# EasyEDA Pro project electronBot-AI_2025-11-24.epro

# Schematic BaseConnector
Board Name: BaseConnector; Create Date: 2025-05-26; Page Name: P1; Project Name: electronBot-AI; Schematic Name: BaseConnector; Update Date: 2025-05-26; Company: 嘉立创EDA; Page Size: A4; Version: V1.0
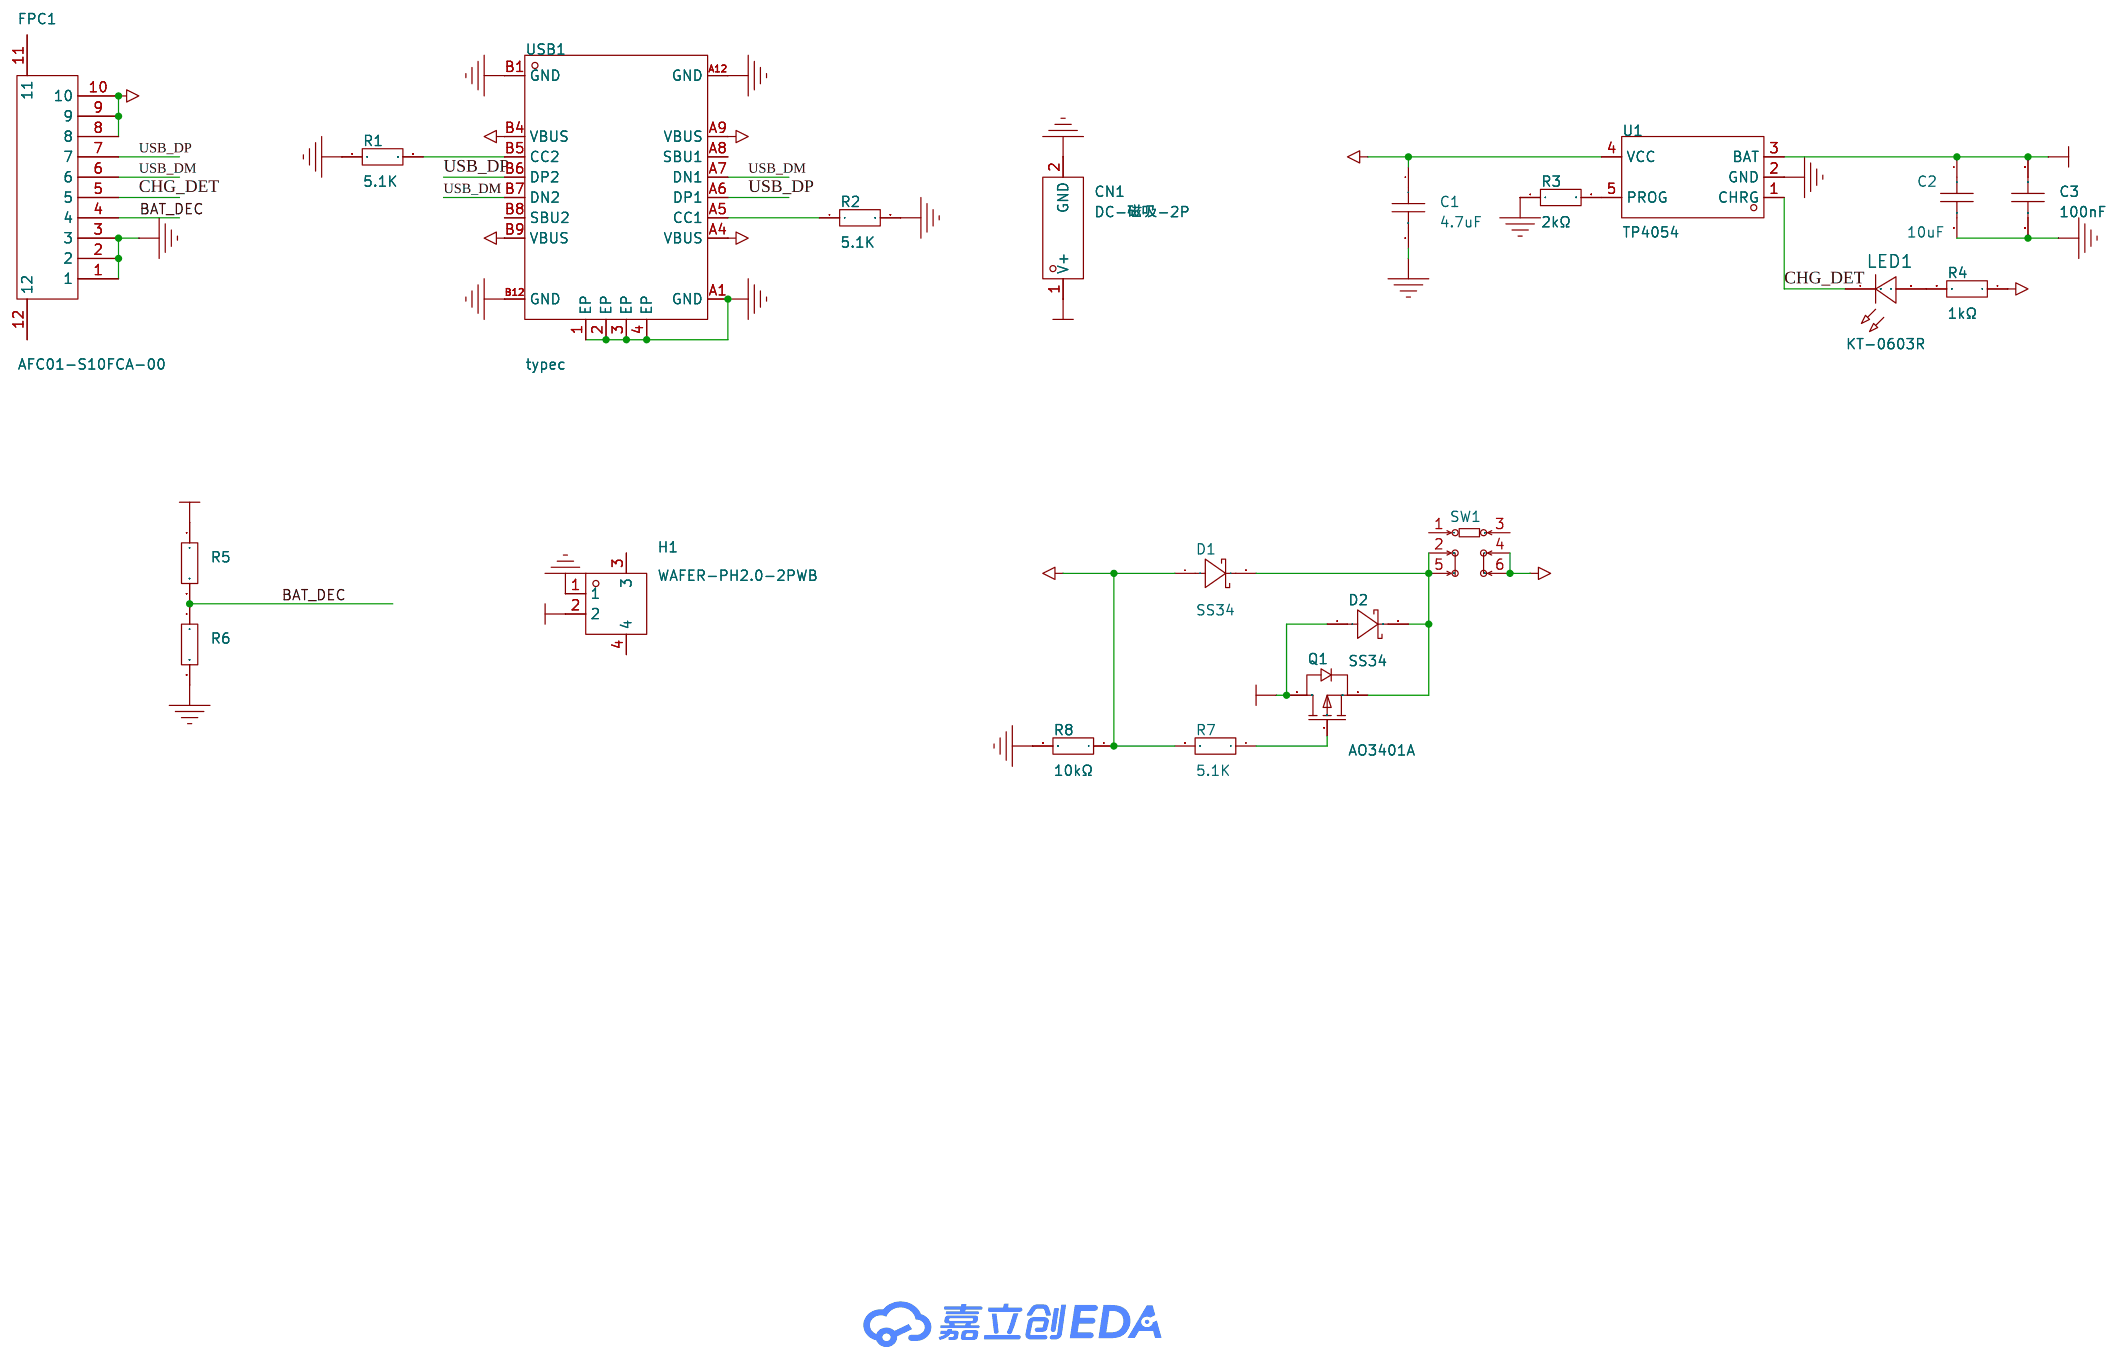
[diagram p0: schematic sheet]

## Parts
C1  4.7uF  [C0603]
C2  10uF  [C0603]
C3  100nF  [C0603]
CN1  DC-磁吸-2P  [2.5X2Pcixi]
D1  SS34  [SMA_L4.3-W2.6-LS5.0-FD]
D2  SS34  [SMA_L4.3-W2.6-LS5.0-FD]
FPC1  AFC01-S10FCA-00  [FPC-SMD_P0.5-10P_FGS-XJ-H2.0]
H1  WAFER-PH2.0-2PWB  [CONN-SMD_2P-P2.00_XUNPU_WAFER-PH2.0-2PWB]
LED1  KT-0603R  [LED0603-RD]
Q1  AO3401A  [SOT-23_L2.9-W1.3-P1.90-LS2.4-BR]
R1  5.1K  [R0603]
R2  5.1K  [R0603]
R3  2kΩ  [R0603]
R4  1kΩ  [R0603]
R5  100kΩ  [R0603]
R6  100kΩ  [R0603]
R7  5.1K  [R0603]
R8  10kΩ  [R0603]
SW1  XKB5858-Z-E  [SW-TH_XKB5858-Z-E]
U1  TP4054  [TSOT-23-5_L2.9-W1.6-P0.95-LS2.8-BR]
USB1  typec  [USB-C-SMD_KH-TYPE-C-16P]

## Library data of the parts
C1 = CL10A475KO8NNNC: 容值:4.7uF;精度:±10%;额定电压:16V;材质(温度系数):X5R;; LCSC Part Name: 4.7uF ±10% 16V; Supplier Part: C19666; Manufacturer: SAMSUNG(三星); Supplier Footprint: 0603; JLCPCB Part Class: Basic Part; Datasheet: https://atta.szlcsc.com/upload/public/pdf/source/20160218/1457707763339.pdf; Supplier: LCSC; Tolerance: ±10%; Voltage Rated: 16V; Temperature Coefficient: X5R
C2 = CL10A106KP8NNNC: 容值:10uF;精度:±10%;额定电压:10V;材质(温度系数):X5R;; LCSC Part Name: 10uF ±10% 10V; Supplier Part: C19702; Manufacturer: SAMSUNG(三星); Supplier Footprint: 0603; JLCPCB Part Class: Basic Part; Datasheet: https://atta.szlcsc.com/upload/public/pdf/source/20160218/1457707763339.pdf; Supplier: LCSC; Tolerance: ±10%; Voltage Rated: 10V; Temperature Coefficient: X5R
C3 = CC0603KRX7R9BB104: 容值:100nF;精度:±10%;额定电压:50V;材质(温度系数):X7R;; LCSC Part Name: 100nF ±10% 50V; Supplier Part: C14663; Manufacturer: YAGEO(国巨); Supplier Footprint: 0603; JLCPCB Part Class: Basic Part; Datasheet: https://atta.szlcsc.com/upload/public/pdf/source/20180910/C282072_33301C7F631E79921B82A8DAC6BCC5B3.pdf; Supplier: LCSC; Tolerance: ±10%; Voltage Rated: 50V; Temperature Coefficient: X7R
CN1 = DC-磁吸-2P: Supplier Part: C9900021679; Supplier Footprint: DIP-2; Supplier: LCSC
D1 D2 = SS34_C7420365: 二极管配置:独立式;正向压降(Vf):550mV@3.0A;直流反向耐压(Vr):40V;平均整流电流(Io):3A;; LCSC Part Name: 电压:40V 电流:3A; Supplier Part: C7420365; Manufacturer: 宏迦橙; Supplier Footprint: SMA(DO-214AC); JLCPCB Part Class: 扩展库; Datasheet: https://atta.szlcsc.com/upload/public/pdf/source/20230828/75438452AEE6C276EDA92B2AF599BE05.pdf; Supplier: LCSC; Diode Configuration: 独立式; Forward Voltage (Vf@If): 550mV@3.0A; Reverse Voltage (Vr): 40V; Average Rectified Current (Io): 3A; Reverse Leakage Current (Ir): 200uA@40V; Peak forward surge current: 80A
FPC1 = AFC01-S10FCA-00: 锁定特性:翻盖式;触点类型:下接;触点数量:10P;间距:0.5mm;安装类型:卧贴;; LCSC Part Name: 间距:0.5mm P数:10P 翻盖式 下接; Supplier Part: C262659; Manufacturer: JS(钜硕电子); Supplier Footprint: SMD,P=0.5mm,卧贴; Datasheet: https://atta.szlcsc.com/upload/public/pdf/source/20190816/C413942_2A72D1AC756EAE17EEDF756A339D4500.pdf; Supplier: LCSC; Locking Feature: 翻盖式; Contact Type: 下接; Number of Contacts: 10P; Pitch: 0.5mm; Mounting Type: 卧贴; FFC, FCB Thickness: 0.3mm; Height Above Board: 2mm
H1 = WAFER-PH2.0-2PWB: 插针结构:1x2P;间距:2mm;安装方式:卧贴;参考系列:PH;总PIN数:2P;排数:1;每排PIN数:2;行距:-;额定电流:2A;触头材质:黄铜;触头镀层:-;工作温度:-25℃~+85℃;; LCSC Part Name: 1x2P 间距:2mm 卧贴 系列:PH; Supplier Part: C3029440; Manufacturer: XUNPU(讯普); Supplier Footprint: SMD,P=2mm,卧贴; Datasheet: https://atta.szlcsc.com/upload/public/pdf/source/20220527/83903C18429EFE4C9EEE8C529A248431.pdf; Supplier: LCSC; Pins Structure: 1x2P; Pitch: 2mm; Mounting Type: 卧贴; Reference Series: PH; Number of Pins: 2P; Number of Rows: 1; Number of PINs Per Row: 2; Current Rating: 2A; Contact Material: 黄铜; Operating Temperature: -25℃~+85℃; Voltage Rating: 250V; Plastic Material: LCP; Supplementary Features: 辅助焊脚; Color: 米色; Z-Height of the Board: 5.6mm; X-Length of Bottom Edge on Board (Spacing Line): 8mm; Y-Width of Bottom Edge on Board: 8.5mm
LED1 = KT-0603R: 发光颜色:红色;功率:-;正向电流:-;主波长:-;二极管配置:-;透镜颜色:-;色温:-;发光角度:-;载带方式:-;工作温度:-40℃~+85℃;; LCSC Part Name: 0603 红灯 高亮; Supplier Part: C2286; Manufacturer: KENTO; Supplier Footprint: 0603; JLCPCB Part Class: Basic Part; Datasheet: https://atta.szlcsc.com/upload/public/pdf/source/20160616/1466072038404.pdf; Supplier: LCSC; Emitted Color: 红色; Operating Temperature: -40℃~+85℃
Q1 = AO3401A_C347476: 类型:1个P沟道;漏源电压(Vdss):30V;连续漏极电流(Id):4.2A;导通电阻(RDS(on)@Vgs,Id):50mΩ@10V;功率(Pd):1.4W;阈值电压(Vgs(th)@Id):400mV@250uA;; LCSC Part Name: 1个P沟道 耐压:30V 电流:4.2A; Supplier Part: C347476; Manufacturer: UMW(友台半导体); Supplier Footprint: SOT-23; JLCPCB Part Class: 扩展库; Datasheet: https://atta.szlcsc.com/upload/public/pdf/source/20231109/42F312EBB081D72F04A7E8221BFFAF9D.pdf; Supplier: LCSC; Type: 1个P沟道; Drain Source Voltage (Vdss): 30V; Continuous Drain Current (Id): 4.2A; Drain Source On Resistance (RDS(on)@Vgs,Id): 50mΩ@10V; Power Dissipation (Pd): 1.4W; Gate Threshold Voltage (Vgs(th)@Id): 400mV@250uA; Total Gate Charge (Qg@Vgs): 9.4nC@4.5V; Input Capacitance (Ciss@Vds): 954pF; Reverse Transfer Capacitance (Crss@Vds): 77pF; Operating Temperature: -55℃~+150℃
R1 R2 R7 = Res_0603: Supplier Footprint: 0603
R3 = 0603WAF2001T5E: 阻值:2kΩ;精度:±1%;功率:100mW;温度系数:±100ppm/℃;电阻类型:厚膜电阻;; LCSC Part Name: 2kΩ ±1% 100mW 厚膜电阻; Supplier Part: C22975; Manufacturer: UNI-ROYAL(厚声); Supplier Footprint: 0603; JLCPCB Part Class: Basic Part; Datasheet: https://atta.szlcsc.com/upload/public/pdf/source/20200306/C422600_1E6D84923E4A46A82E41ADD87F860B5C.pdf; Supplier: LCSC; Tolerance: ±1%; Power(Watts): 100mW; Overload Voltage (Max): 75V; Temperature Coefficient: ±100ppm/℃; Type: 厚膜电阻; Operating Temperature Range: -55℃~+155℃
R4 = 0603WAF1001T5E: 电阻类型:厚膜电阻;阻值:1kΩ;精度:±1%;功率:100mW;最大工作电压:75V;温度系数:±100ppm/℃;; LCSC Part Name: 1kΩ ±1% 100mW 厚膜电阻; Supplier Part: C21190; Manufacturer: UNI-ROYAL(厚声); Supplier Footprint: 0603; JLCPCB Part Class: Basic Part; Datasheet: https://atta.szlcsc.com/upload/public/pdf/source/20200306/C422600_1E6D84923E4A46A82E41ADD87F860B5C.pdf; Supplier: LCSC; Type: 厚膜电阻; Tolerance: ±1%; Power(Watts): 100mW; Overload Voltage (Max): 75V; Temperature Coefficient: ±100ppm/℃; Operating Temperature Range: -55℃~+155℃
R5 R6 = 0603WAF1003T5E: 电阻类型:厚膜电阻;阻值:100kΩ;精度:±1%;功率:100mW;最大工作电压:75V;温度系数:±100ppm/℃;; LCSC Part Name: 100kΩ ±1%; Supplier Part: C25803; Manufacturer: UNI-ROYAL(厚声); Supplier Footprint: 0603; JLCPCB Part Class: Basic Part; Datasheet: https://atta.szlcsc.com/upload/public/pdf/source/20200306/C422600_1E6D84923E4A46A82E41ADD87F860B5C.pdf; Supplier: LCSC; Type: 厚膜电阻; Tolerance: ±1%; Power(Watts): 1/10W; Temperature Coefficient: ±100ppm/℃; Overload Voltage (Max): 75V; Operating Temperature Range: -55℃~+155℃
R8 = 0603WAF1002T5E: 电阻类型:厚膜电阻;阻值:10kΩ;精度:±1%;功率:100mW;; LCSC Part Name: 厚膜电阻 10kΩ ±1% 100mW; Supplier Part: C25804; Manufacturer: UNI-ROYAL(厚声); Supplier Footprint: 0603; JLCPCB Part Class: 基础库; Datasheet: https://atta.szlcsc.com/upload/public/pdf/source/20200306/C422600_1E6D84923E4A46A82E41ADD87F860B5C.pdf; Supplier: LCSC; Type: 厚膜电阻; Tolerance: ±1%; Power(Watts): 100mW; Temperature Coefficient: ±100ppm/℃; Overload Voltage (Max): 75V; Operating Temperature Range: -55℃~+155℃
SW1 = XKB5858-Z-E: 自锁/无锁:自锁;安装方式:卧插;触点电流:100mA;额定电压 (AC):250V;额定电压 (DC):30V;带灯:不带;作用力:2.5N;机械寿命:10万次;; Supplier Part: C780038; Manufacturer: XKB Connection(中国星坤); Supplier Footprint: 插件; JLCPCB Part Class: 扩展库; Datasheet: https://atta.szlcsc.com/upload/public/pdf/source/20211011/56D3FA9FC185EAC41365C3B37B684CC1.pdf; Supplier: LCSC; Self Lock / No Lock: 自锁; Actuator Style: 方形按钮; Mounting Style: 卧插; Contact Current: 100mA; Voltage Rating (AC): 250V; Voltage Rating (DC): 30V; Insulation Resistance: 100MΩ; Actuator/Cap Color: 白色; With Lamp: 不带; Pin Style: PC引脚; Operating Force: 2.5N; Operating Temperature: -15℃~+55℃; Mechanical Life: 10万次
U1 = TP4054_C668215: 电源电压:6.5V;最大充电电流:500mA;电池类型:锂离子/聚合物;电池节数:1;; Supplier Part: C668215; Manufacturer: UMW(友台半导体); Supplier Footprint: SOT-23-5L; JLCPCB Part Class: 扩展库; Datasheet: https://atta.szlcsc.com/upload/public/pdf/source/20231109/1E60770826C4E1A0E5898BBC08FF3A57.pdf; Supplier: LCSC; Supply Voltage: 6.5V; Maximum Charge Current: 500mA; Type of Battery: 锂离子/聚合物; Number of Cells: 1; Operating Temperature: -40℃~+85℃
USB1 = typec: Supplier Part: C9900016956; Supplier Footprint: typec 12p; Supplier: LCSC

## Nets
GND: C1.2 C2.2 C3.2 CN1.2(GND) FPC1.1 FPC1.2 FPC1.3 H1.1 R1.1 R2.2 R3.1 R6.2 R8.2 U1.2(GND) USB1.1(EP) USB1.2(EP) USB1.3(EP) USB1.4(EP) USB1.A1(GND) USB1.A12(GND) USB1.B1(GND) USB1.B12(GND)
VBAT: C2.1 C3.1 CN1.1(V+) D2.1(A) H1.2 Q1.3(D) R5.1 U1.3(BAT)
VBUS: FPC1.8 FPC1.9 FPC1.10 SW1.4 SW1.6
VBUS_IN: C1.1 D1.1(A) R4.1 R7.2 R8.1 U1.4(VCC) USB1.A4(VBUS) USB1.A9(VBUS) USB1.B4(VBUS) USB1.B9(VBUS)
BAT_DEC: FPC1.4 R5.2 R6.1
CHG_DET: FPC1.5 LED1.1(C) U1.1(CHRG)
USB_DM: FPC1.6 USB1.A7(DN1) USB1.B7(DN2)
USB_DP: FPC1.7 USB1.A6(DP1) USB1.B6(DP2)
$1N1500: R1.2 USB1.B5(CC2)
$1N1502: R2.1 USB1.A5(CC1)
$1N5040: R3.2 U1.5(PROG)
$1N5043: LED1.2(A) R4.2
$1N5835: Q1.1(G) R7.1
$1N5920: D1.2(K) D2.2(K) Q1.2(S) SW1.2 SW1.5

Not connected (* = marked no-connect by the designer): FPC1 11 12; H1 3 4; SW1 1 3; USB1 A8(SBU1) B8(SBU2)

# Schematic connectBoard
Board Name: connectBoard; Create Date: 2025-05-26; Page Name: P1; Project Name: electronBot-AI; Schematic Name: connectBoard; Update Date: 2025-05-26; Company: 嘉立创EDA; Page Size: A4; Version: V1.0
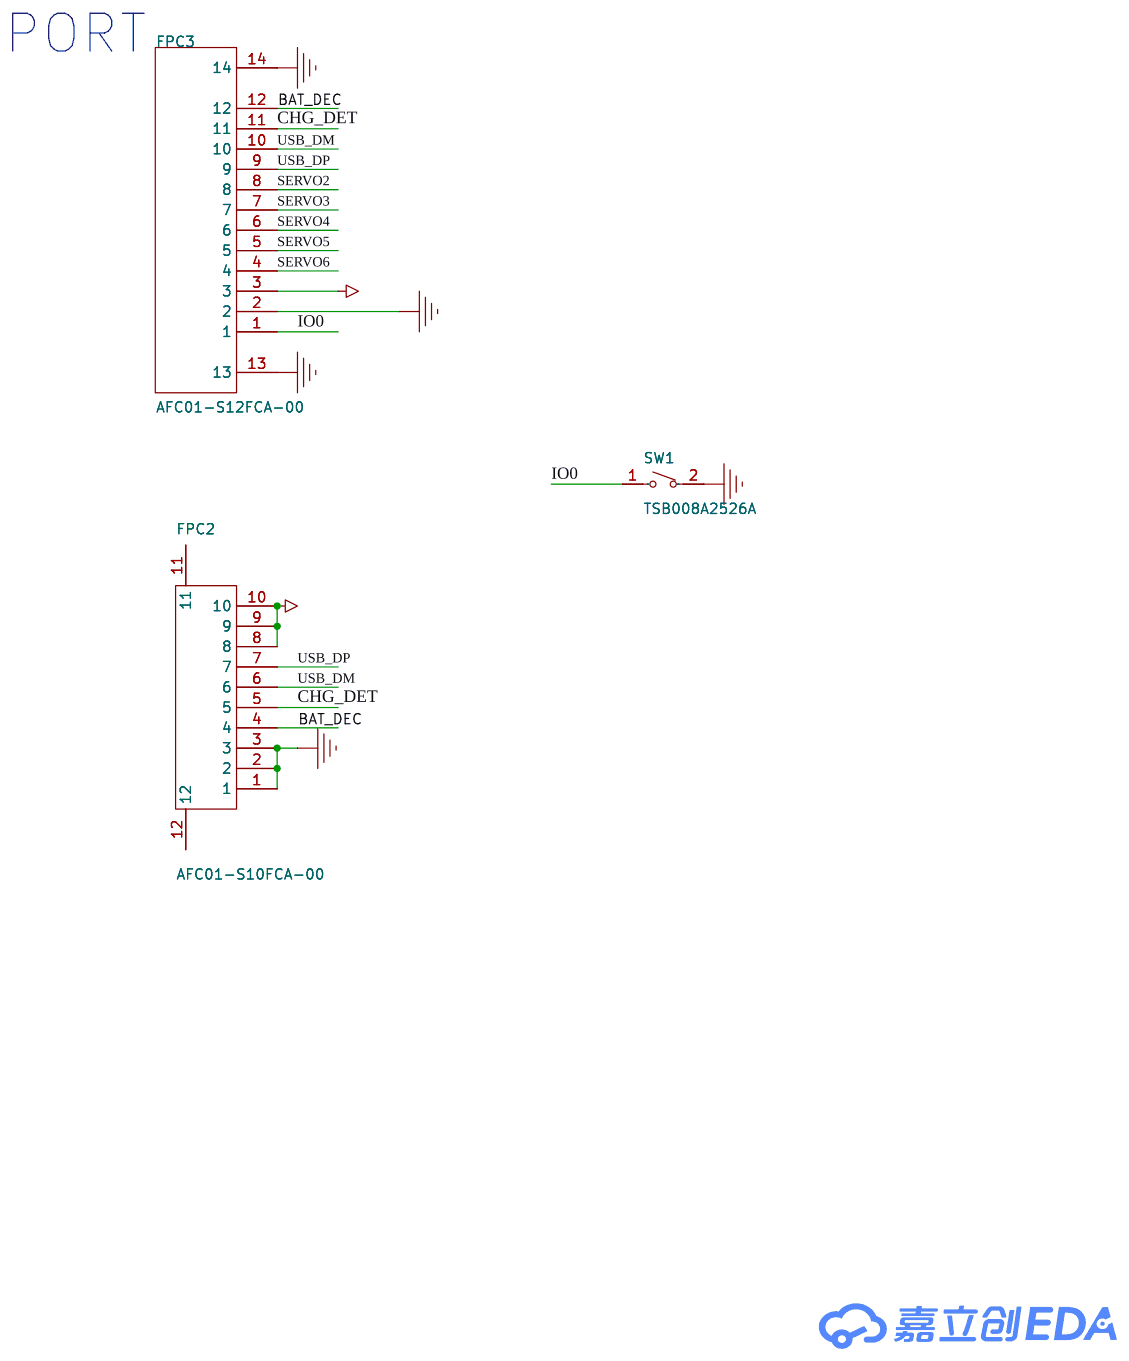
[diagram p1: schematic sheet]

## Parts
FPC2  AFC01-S10FCA-00  [FPC-SMD_P0.5-10P_FGS-XJ-H2.0]
FPC3  AFC01-S12FCA-00  [FPC-SMD_AFC01-S12FCA-00]
SW1  TSB008A2526A  [SW-SMD_L6.0-W3.5-LS8.0]

## Library data of the parts
FPC2 = AFC01-S10FCA-00: 锁定特性:翻盖式;触点类型:下接;触点数量:10P;间距:0.5mm;安装类型:卧贴;; LCSC Part Name: 间距:0.5mm P数:10P 翻盖式 下接; Supplier Part: C262659; Manufacturer: JS(钜硕电子); Supplier Footprint: SMD,P=0.5mm,卧贴; Datasheet: https://atta.szlcsc.com/upload/public/pdf/source/20190816/C413942_2A72D1AC756EAE17EEDF756A339D4500.pdf; Supplier: LCSC; Locking Feature: 翻盖式; Contact Type: 下接; Number of Contacts: 10P; Pitch: 0.5mm; Mounting Type: 卧贴; FFC, FCB Thickness: 0.3mm; Height Above Board: 2mm
FPC3 = AFC01-S12FCA-00: 锁定特性:翻盖式;触点类型:下接;触点数量:12P;间距:0.5mm;安装类型:卧贴;; LCSC Part Name: 间距:0.5mm P数:12P 翻盖式 下接; Supplier Part: C262661; Manufacturer: JS(钜硕电子); Supplier Footprint: SMD,P=0.5mm,卧贴; JLCPCB Part Class: 扩展库; Datasheet: https://atta.szlcsc.com/upload/public/pdf/source/20190816/C413942_2A72D1AC756EAE17EEDF756A339D4500.pdf; Supplier: LCSC; Locking Feature: 翻盖式; Contact Type: 下接; Number of Contacts: 12P; Pitch: 0.5mm; Mounting Type: 卧贴; FFC, FCB Thickness: 0.3mm; Height Above Board: 2mm
SW1 = TSB008A2526A: 按钮形状:矩形按钮;作用力:260gf;安装方式:立贴;开关长度:6mm;开关宽度:3.5mm;开关高度:2.5mm;触点电流:50mA;额定电压(AC):-;额定电压(DC):12V;机械寿命:-;; LCSC Part Name: 6*3.5*2.5mm 立贴 轻触开关; Supplier Part: C2888456; Manufacturer: BZCN(博众电气); Supplier Footprint: SMD; JLCPCB Part Class: 扩展库; Datasheet: https://atta.szlcsc.com/upload/public/pdf/source/20210826/69353A4A5CF55ED01B57EB383090AA0F.pdf; Supplier: LCSC; Actuator Style: 矩形按钮; Operating Force: 260gf; Mounting Style: 立贴; Switch Length: 6mm; Switch Width: 3.5mm; Switch Height: 2.5mm; Contact Current: 50mA; Voltage Rating (DC): 12V; Actuator/Cap Color: 白色

## Nets
GND: FPC2.1 FPC2.2 FPC2.3 FPC3.2 FPC3.13 FPC3.14 SW1.2
VBUS: FPC2.8 FPC2.9 FPC2.10 FPC3.3
BAT_DEC: FPC2.4 FPC3.12
CHG_DET: FPC2.5 FPC3.11
IO0: FPC3.1 SW1.1
SERVO2: FPC3.8
SERVO3: FPC3.7
SERVO4: FPC3.6
SERVO5: FPC3.5
SERVO6: FPC3.4
USB_DM: FPC2.6 FPC3.10
USB_DP: FPC2.7 FPC3.9

Not connected (* = marked no-connect by the designer): FPC2 11 12

## Notes on the sheet
- PORT

# Schematic mainBoard
Board Name: mainBoard; Create Date: 2025-05-26; Page Name: ElectronBot; Project Name: electronBot-AI; Schematic Name: mainBoard; Update Date: 2025-05-26; Company: 嘉立创EDA; Page Size: A4; Version: V1.0
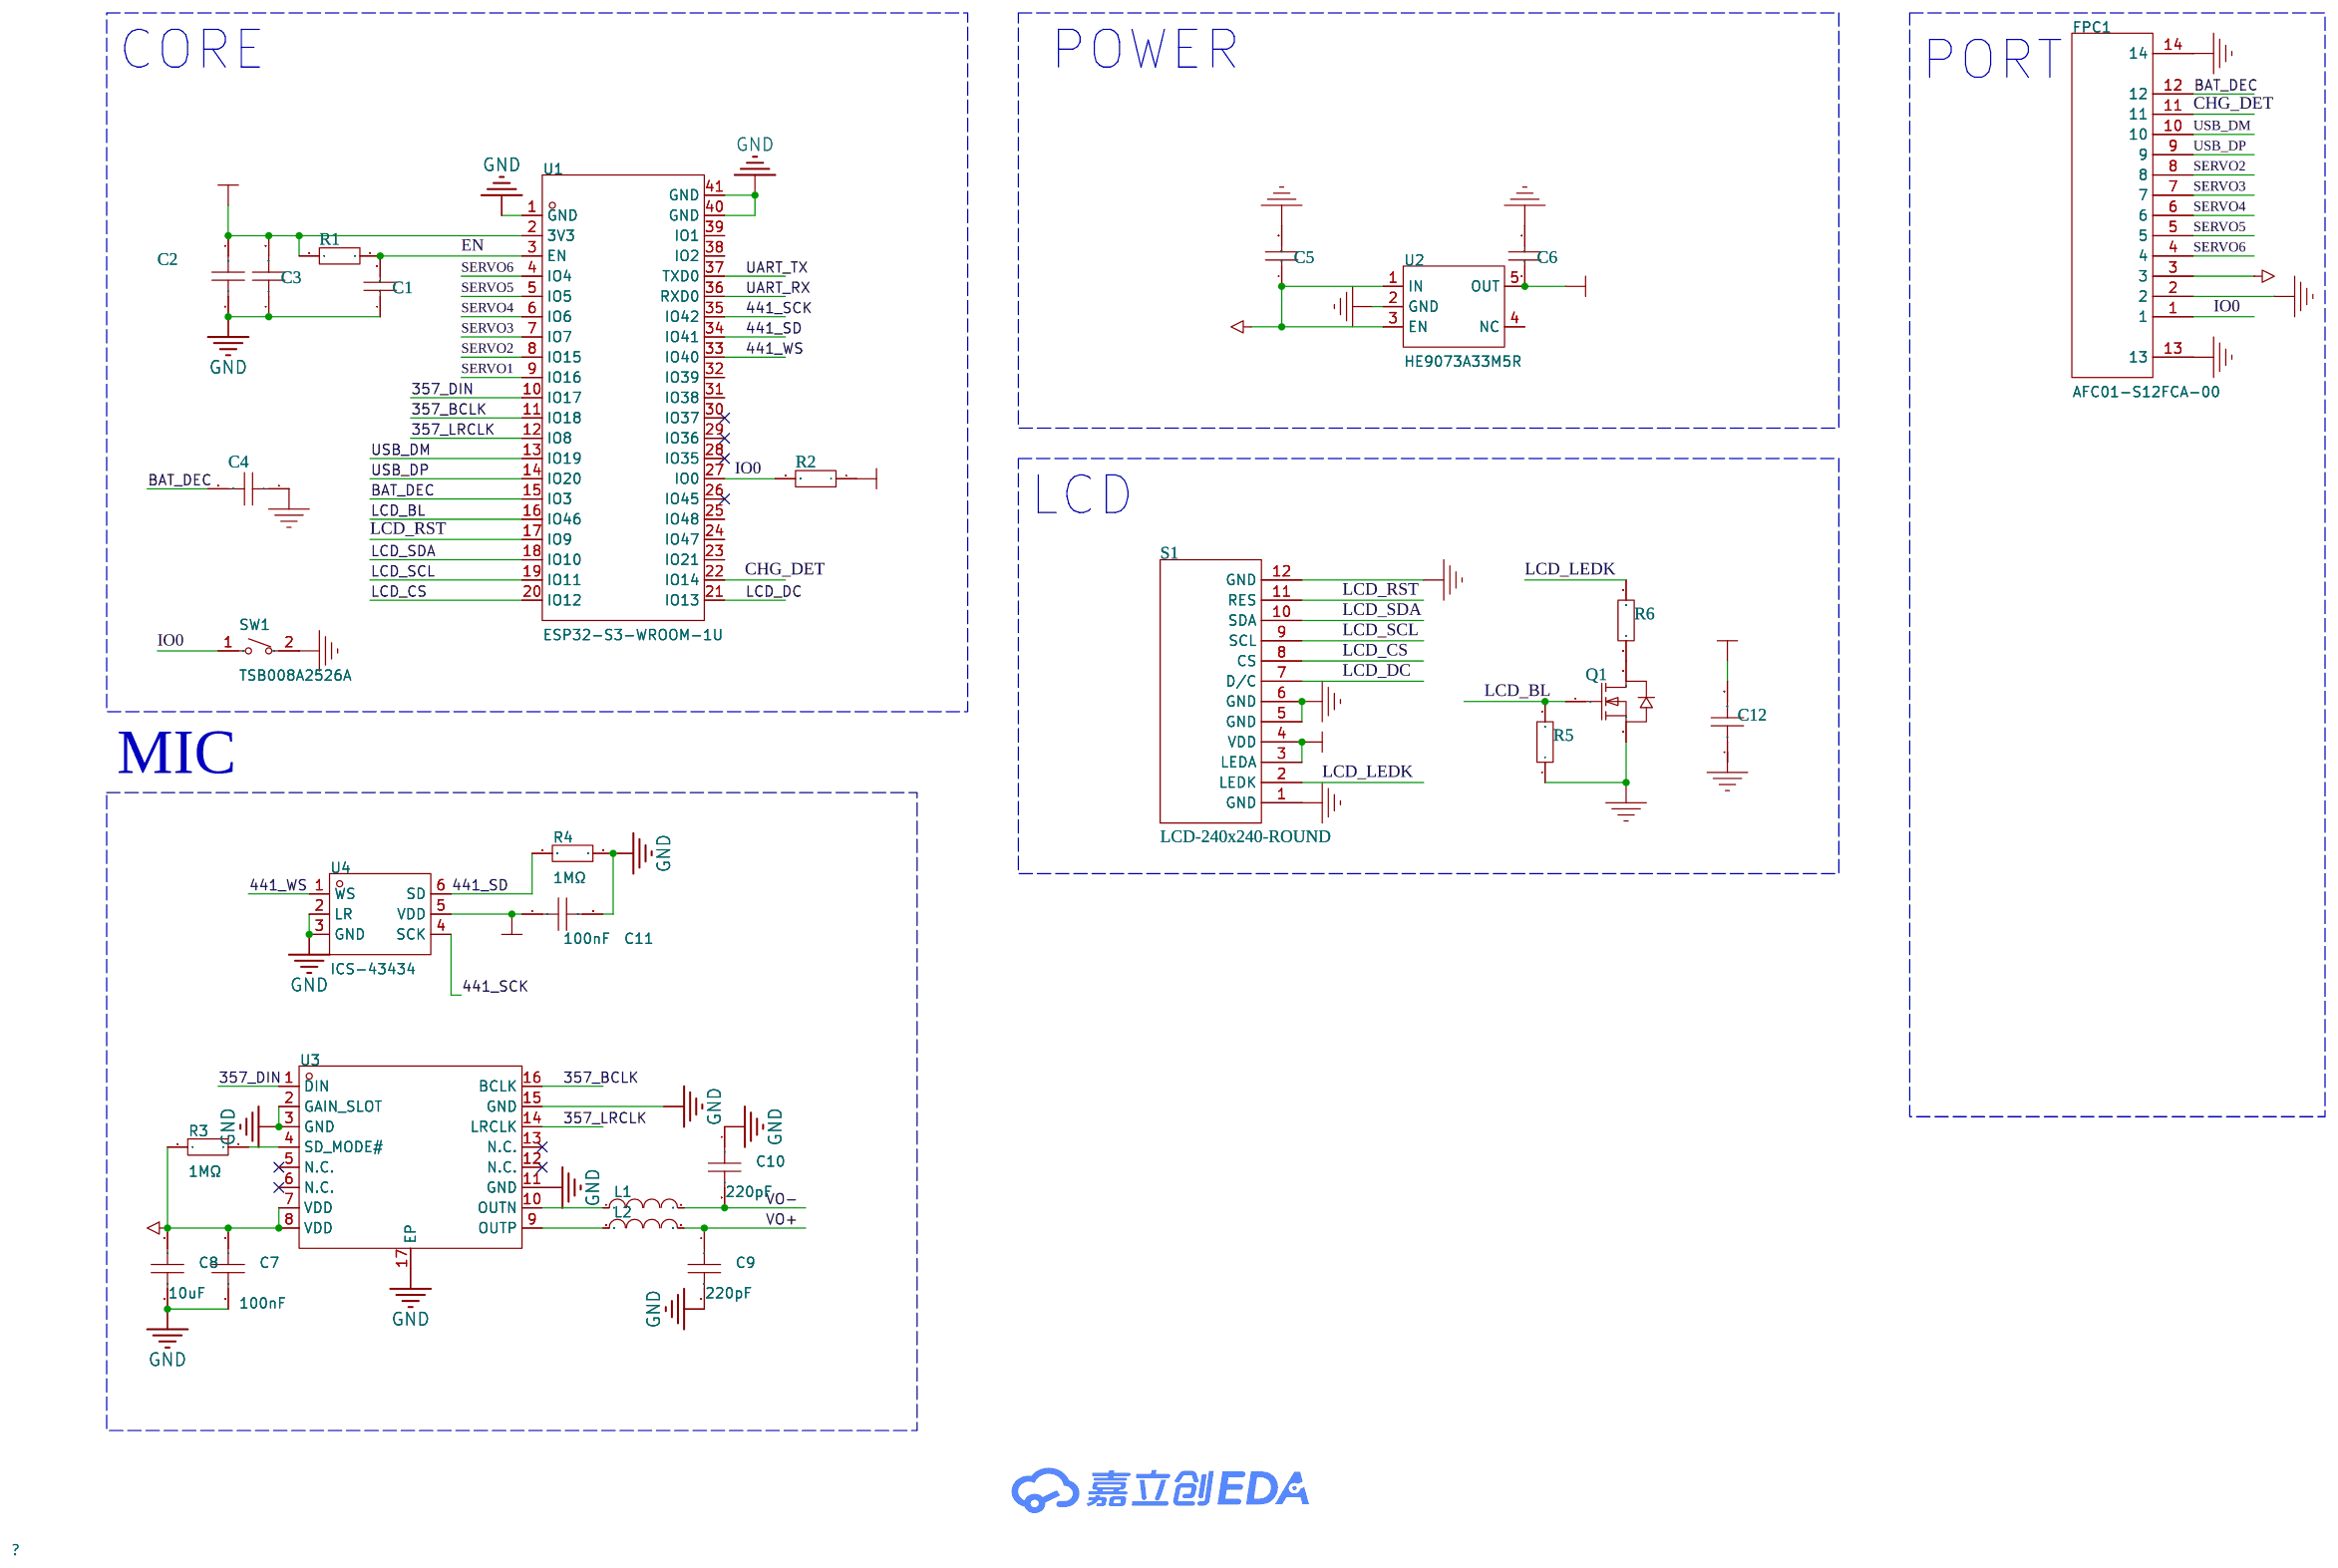
[diagram p2: schematic sheet]

## Parts
C1  1uF  [C0603]
C2  10uF  [C0603]
C3  100nF  [C0603]
C4  100nF  [C0603]
C5  10uF  [C0603]
C6  10uF  [C0603]
C7  100nF  [C0603]
C8  10uF  [C0603]
C9  220pF  [C0603]
C10  220pF  [C0603]
C11  100nF  [C0603]
C12  100nF  [C0603]
FPC1  AFC01-S12FCA-00  [FPC-SMD_AFC01-S12FCA-00]
L1  BLM18PG121SN1D  [L0603]
L2  BLM18PG121SN1D  [L0603]
Q1  AO3400A  [SOT-23-3_L2.9-W1.3-P1.90-LS2.4-BR]
R1  10kΩ  [R0603]
R2  10kΩ  [R0603]
R3  1MΩ  [R0603]
R4  1MΩ  [R0603]
R5  10kΩ  [R0603]
R6  10Ω  [R0603]
S1  LCD-240x240-ROUND  [LCD-240x240-ROUND]
SW1  TSB008A2526A  [SW-SMD_L6.0-W3.5-LS8.0]
U1  ESP32-S3-WROOM-1U  [WIRELM-SMD_ESP32-S3-WROOM-1U]
U2  HE9073A33M5R  [SOT-23-5_L3.0-W1.7-P0.95-LS2.8-BL]
U3  MAX98357AETE+T  [TQFN-16_L3.0-W3.0-P0.50-BL-EP1.5]
U4  ICS-43434  [MIC-SMD_6P-L3.5-W2.7-P0.90-BL]

## Library data of the parts
C1 = CL10A105KB8NNNC: 容值:1uF;精度:±10%;额定电压:50V;材质(温度系数):X5R;; LCSC Part Name: 1uF ±10% 50V; Supplier Part: C15849; Manufacturer: SAMSUNG(三星); Supplier Footprint: 0603; JLCPCB Part Class: Basic Part; Datasheet: https://atta.szlcsc.com/upload/public/pdf/source/20160218/1457707763339.pdf; Supplier: LCSC; Tolerance: ±10%; Voltage Rated: 50V; Temperature Coefficient: X5R
C2 C5 C6 C8 = CL10A106KP8NNNC: 容值:10uF;精度:±10%;额定电压:10V;材质(温度系数):X5R;; LCSC Part Name: 10uF ±10% 10V; Supplier Part: C19702; Manufacturer: SAMSUNG(三星); Supplier Footprint: 0603; JLCPCB Part Class: Basic Part; Datasheet: https://atta.szlcsc.com/upload/public/pdf/source/20160218/1457707763339.pdf; Supplier: LCSC; Tolerance: ±10%; Voltage Rated: 10V; Temperature Coefficient: X5R
C3 C4 C7 C11 C12 = CC0603KRX7R9BB104: 容值:100nF;精度:±10%;额定电压:50V;材质(温度系数):X7R;; LCSC Part Name: 100nF ±10% 50V; Supplier Part: C14663; Manufacturer: YAGEO(国巨); Supplier Footprint: 0603; JLCPCB Part Class: Basic Part; Datasheet: https://atta.szlcsc.com/upload/public/pdf/source/20180910/C282072_33301C7F631E79921B82A8DAC6BCC5B3.pdf; Supplier: LCSC; Tolerance: ±10%; Voltage Rated: 50V; Temperature Coefficient: X7R
C9 C10 = CL10B221KB8NNNC: 容值:220pF;精度:±10%;额定电压:50V;材质(温度系数):X7R;; LCSC Part Name: 220pF ±10% 50V; Supplier Part: C1603; Manufacturer: SAMSUNG(三星); Supplier Footprint: 0603; JLCPCB Part Class: Basic Part; Datasheet: https://atta.szlcsc.com/upload/public/pdf/source/20160218/1457707763339.pdf; Supplier: LCSC; Tolerance: ±10%; Voltage Rated: 50V; Temperature Coefficient: X7R
FPC1 = AFC01-S12FCA-00: 锁定特性:翻盖式;触点类型:下接;触点数量:12P;间距:0.5mm;安装类型:卧贴;; LCSC Part Name: 间距:0.5mm P数:12P 翻盖式 下接; Supplier Part: C262661; Manufacturer: JS(钜硕电子); Supplier Footprint: SMD,P=0.5mm,卧贴; JLCPCB Part Class: 扩展库; Datasheet: https://atta.szlcsc.com/upload/public/pdf/source/20190816/C413942_2A72D1AC756EAE17EEDF756A339D4500.pdf; Supplier: LCSC; Locking Feature: 翻盖式; Contact Type: 下接; Number of Contacts: 12P; Pitch: 0.5mm; Mounting Type: 卧贴; FFC, FCB Thickness: 0.3mm; Height Above Board: 2mm
L1 L2 = BLM18PG121SN1D: 标称阻抗@测试频率:120Ω@100MHz;误差:±25%;直流电阻(RDC):50mΩ;; LCSC Part Name: 单路 0603磁珠 阻抗120Ω@100MHz; Supplier Part: C14709; Manufacturer: muRata(村田); Supplier Footprint: 0603; JLCPCB Part Class: Extended Part; Datasheet: https://atta.szlcsc.com/upload/public/pdf/source/20130704/1457706621422.pdf; Supplier: LCSC; Impedance @ Frequency: 120Ω@100MHz; Tolerance: ±25%; DC Resistance: 50mΩ; Current Rating: 2A; Circuits: 1
Q1 = AO3400A_C20917: 类型:1个N沟道;漏源电压(Vdss):30V;连续漏极电流(Id):5.7A;导通电阻(RDS(on)@Vgs,Id):26.5mΩ@10V,5.7A;功率(Pd):1.4W;阈值电压(Vgs(th)@Id):1.5V@250uA;; LCSC Part Name: 1个N沟道 耐压:30V 电流:5.7A; Supplier Part: C20917; Manufacturer: AOS; Supplier Footprint: SOT-23-3L; JLCPCB Part Class: Basic Part; Datasheet: https://atta.szlcsc.com/upload/public/pdf/source/20140107/1457706668533.pdf; Supplier: LCSC; Type: 1个N沟道; Drain Source Voltage (Vdss): 30V; Continuous Drain Current (Id): 5.7A; Drain Source On Resistance (RDS(on)@Vgs,Id): 26.5mΩ@10V,5.7A; Power Dissipation (Pd): 1.4W; Gate Threshold Voltage (Vgs(th)@Id): 1.5V@250uA; Total Gate Charge (Qg@Vgs): 7nC@4.5V; Input Capacitance (Ciss@Vds): 630pF@15V; Operating Temperature: -55℃~+150℃@(Tj)
R1 R2 R5 = 0603WAF1002T5E: 电阻类型:厚膜电阻;阻值:10kΩ;精度:±1%;功率:100mW;最大工作电压:75V;温度系数:±100ppm/℃;; LCSC Part Name: 厚膜电阻 10kΩ ±1% 100mW; Supplier Part: C25804; Manufacturer: UNI-ROYAL(厚声); Supplier Footprint: 0603; JLCPCB Part Class: 基础库; Datasheet: https://atta.szlcsc.com/upload/public/pdf/source/20200306/C422600_1E6D84923E4A46A82E41ADD87F860B5C.pdf; Supplier: LCSC; Type: 厚膜电阻; Tolerance: ±1%; Power(Watts): 100mW; Temperature Coefficient: ±100ppm/℃; Overload Voltage (Max): 75V; Operating Temperature Range: -55℃~+155℃
R3 R4 = 0603WAF1004T5E: 电阻类型:厚膜电阻;阻值:1MΩ;精度:±1%;功率:100mW;最大工作电压:75V;温度系数:±100ppm/℃;; LCSC Part Name: 1MΩ ±1% 100mW 厚膜电阻; Supplier Part: C22935; Manufacturer: UNI-ROYAL(厚声); Supplier Footprint: 0603; JLCPCB Part Class: Basic Part; Datasheet: https://atta.szlcsc.com/upload/public/pdf/source/20200306/C422600_1E6D84923E4A46A82E41ADD87F860B5C.pdf; Supplier: LCSC; Type: 厚膜电阻; Tolerance: ±1%; Power(Watts): 100mW; Overload Voltage (Max): 75V; Temperature Coefficient: ±100ppm/℃; Operating Temperature Range: -55℃~+155℃
R6 = 0603WAF100JT5E: 电阻类型:厚膜电阻;阻值:10Ω;精度:±1%;功率:100mW;最大工作电压:75V;温度系数:±400ppm/℃;; LCSC Part Name: 10Ω ±1% 100mW 厚膜电阻; Supplier Part: C22859; Manufacturer: UNI-ROYAL(厚声); Supplier Footprint: 0603; JLCPCB Part Class: Basic Part; Datasheet: https://atta.szlcsc.com/upload/public/pdf/source/20200306/C422600_1E6D84923E4A46A82E41ADD87F860B5C.pdf; Supplier: LCSC; Type: 厚膜电阻; Tolerance: ±1%; Power(Watts): 100mW; Overload Voltage (Max): 75V; Temperature Coefficient: ±400ppm/℃; Operating Temperature Range: -55℃~+155℃
S1 = LCD-240x240-ROUND: --ʾ--; Library Name: mLib
SW1 = TSB008A2526A: 按钮形状:矩形按钮;作用力:260gf;安装方式:立贴;开关长度:6mm;开关宽度:3.5mm;开关高度:2.5mm;触点电流:50mA;额定电压(AC):-;额定电压(DC):12V;机械寿命:-;; LCSC Part Name: 6*3.5*2.5mm 立贴 轻触开关; Supplier Part: C2888456; Manufacturer: BZCN(博众电气); Supplier Footprint: SMD; JLCPCB Part Class: 扩展库; Datasheet: https://atta.szlcsc.com/upload/public/pdf/source/20210826/69353A4A5CF55ED01B57EB383090AA0F.pdf; Supplier: LCSC; Actuator Style: 矩形按钮; Operating Force: 260gf; Mounting Style: 立贴; Switch Length: 6mm; Switch Width: 3.5mm; Switch Height: 2.5mm; Contact Current: 50mA; Voltage Rating (DC): 12V; Actuator/Cap Color: 白色
U1 = ESP32-S3-WROOM-1U: Supplier Part: C9900027631; JLCPCB Part Class: Extended Part; Datasheet: 2022-08-19/232115A/016f24418fe144ee97a228b49982dcda/esp32-s3-wroom-1_wroom-1u_datasheet_cn.pdf; Supplier: LCSC
U2 = HE9073A33M5R: 输出类型:固定;工作电压:7V;输出电压:3.3V;输出电流:500mA;电源纹波抑制比(PSRR):70dB@(1kHz);输出极性:正极;; LCSC Part Name: 输入7V 输出3.3V 500mA; Supplier Part: C723789; Manufacturer: HEERMICR(赫尔半导体); Supplier Footprint: SOT-23-5; JLCPCB Part Class: Extended Part; Datasheet: https://atta.szlcsc.com/upload/public/pdf/source/20200818/C723783_47C0FB0690B3745218579CD1DF0C296C.pdf; Supplier: LCSC; Output Type: 固定; Voltage - Supply: 7V; Output Voltage: 3.3V; Output Current: 500mA; Power Supply Rejection Ratio (PSRR): 70dB@(1kHz); Voltage Dropout: 100mV; standby current: 300nA; Features: 短路保护；低ESR；热保护(TSD)；过流保护(OCP)；带使能; Output Configuration: 正极; Number of Outputs: 1
U3 = MAX98357AETE+T: 功放类型:-;扬声器通道数:单声道;输出功率:3.2Wx2@4Ω;; LCSC Part Name: 微型、低成本、PCM 类 D 级放大器具有 AB 级性能; Supplier Part: C910544; Manufacturer: ADI(亚德诺)/MAXIM(美信); Supplier Footprint: TQFN-16-EP(3x3); JLCPCB Part Class: Extended Part; Datasheet: https://atta.szlcsc.com/upload/public/pdf/source/20210106/C910544_CB6DE4B2CEE254A72E6BDB40E718D281.pdf; Supplier: LCSC; Speaker Channels: 单声道; Output Power: 3.2Wx2@4Ω; Supply Voltage: 2.5V~5.5V; Operating Temperature: -40℃~+85℃
U4 = ICS-43434_C5656610: 指向性:全指向;信噪比:64dB;灵敏度:-;; Supplier Part: C5656610; Manufacturer: TDK InvenSense(应美盛); JLCPCB Part Class: 扩展库; Datasheet: https://atta.szlcsc.com/upload/public/pdf/source/231023/DS-000069-ICS-43434-v1.2-8194c7772d771e21a553109502704f97.pdf; Supplier: LCSC; Direction: 全指向; Supply Voltage: 1.65V~3.63V; Current Consumption: 550uA; SNR(Signal to Noise Ratio): 64dB

## Nets
GND: C1.1 C2.2 C3.1 C4.1 C5.2 C6.2 C7.2 C8.2 C9.2 C10.1 C11.2 C12.1 FPC1.2 FPC1.13 FPC1.14 Q1.2(S) R4.2 R5.1 S1.1(GND) S1.5(GND) S1.6(GND) S1.12(GND) SW1.2 U1.1(GND) U1.40(GND) U1.41(GND) U2.2(GND) U3.2(GAIN_SLOT) U3.3(GND) U3.11(GND) U3.15(GND) U3.17(EP) U4.2(LR) U4.3(GND)
VBUS: C5.1 C7.1 C8.1 FPC1.3 R3.2 U2.1(IN) U2.3(EN) U3.7(VDD) U3.8(VDD)
VCC_3V3: C2.1 C3.2 C6.1 C11.1 C12.2 R1.2 R2.1 S1.3(LEDA) S1.4(VDD) U1.2(3V3) U2.5(OUT) U4.5(VDD)
357_BCLK: U1.11(IO18) U3.16(BCLK)
357_DIN: U1.10(IO17) U3.1(DIN)
357_LRCLK: U1.12(IO8) U3.14(LRCLK)
441_SCK: U1.35(IO42) U4.4(SCK)
441_SD: R4.1 U1.34(IO41) U4.6(SD)
441_WS: U1.33(IO40) U4.1(WS)
BAT_DEC: C4.2 FPC1.12 U1.15(IO3)
CHG_DET: FPC1.11 U1.22(IO14)
EN: C1.2 R1.1 U1.3(EN)
IO0: FPC1.1 R2.2 SW1.1 U1.27(IO0)
LCD_BL: Q1.1(G) R5.2 U1.16(IO46)
LCD_CS: S1.8(CS) U1.20(IO12)
LCD_DC: S1.7(D/C) U1.21(IO13)
LCD_LEDK: R6.2 S1.2(LEDK)
LCD_RST: S1.11(RES) U1.17(IO9)
LCD_SCL: S1.9(SCL) U1.19(IO11)
LCD_SDA: S1.10(SDA) U1.18(IO10)
SERVO1: U1.9(IO16)
SERVO2: FPC1.8 U1.8(IO15)
SERVO3: FPC1.7 U1.7(IO7)
SERVO4: FPC1.6 U1.6(IO6)
SERVO5: FPC1.5 U1.5(IO5)
SERVO6: FPC1.4 U1.4(IO4)
UART_RX: U1.36(RXD0)
UART_TX: U1.37(TXD0)
USB_DM: FPC1.10 U1.13(IO19)
USB_DP: FPC1.9 U1.14(IO20)
VO+: C9.1 L2.2
VO-: C10.2 L1.2
$1N8026: Q1.3(D) R6.1
$1N15184: R3.1 U3.4(SD_MODE#)
$1N15193: L1.1 U3.10(OUTN)
$1N15194: L2.1 U3.9(OUTP)

Not connected (* = marked no-connect by the designer): U1 23(IO21) 24(IO47) 25(IO48) 26(IO45)* 28(IO35)* 29(IO36)* 30(IO37)* 31(IO38) 32(IO39) 38(IO2) 39(IO1); U2 4(NC); U3 5(N.C.)* 6(N.C.)* 12(N.C.)* 13(N.C.)*

## Notes on the sheet
- CORE
- POWER
- PORT
- LCD
- MIC

# Board connectBoard
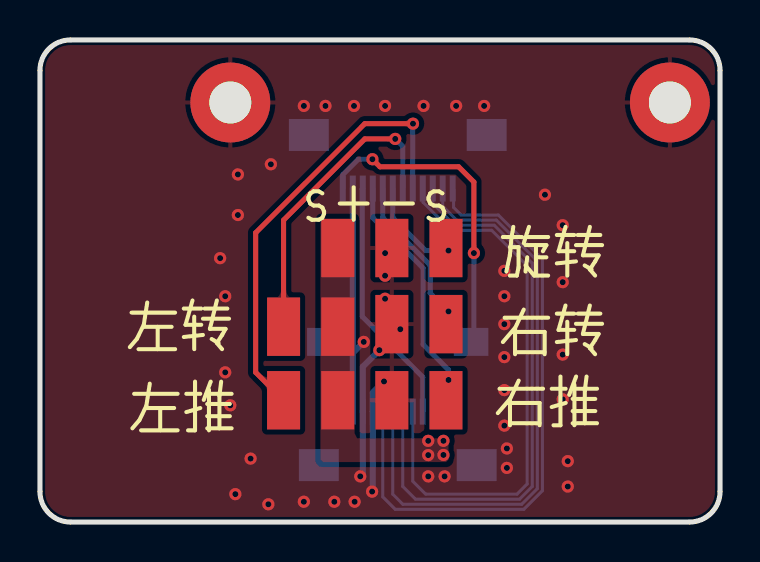
[diagram p3: board, top side]
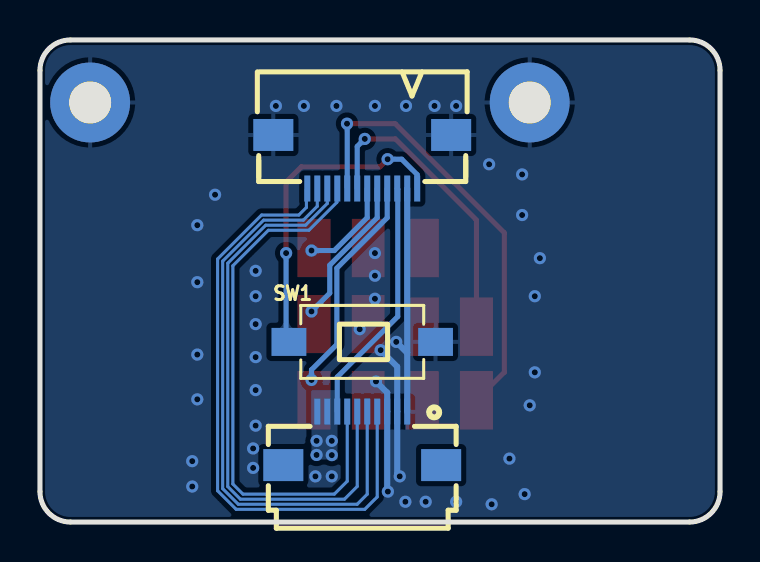
[diagram p4: board, bottom side, seen from below]

Outline 34.04 x 24.13 mm; copper layers: Top Layer, Bottom Layer. Coordinates in mm from the lower left corner of the outline.
Outline path: 0,22.61 0,1.52 arc(0.45,0.45) 1.52,0 32.51,0 arc(33.59,0.45) 34.04,1.52 34.04,22.61 arc(33.59,23.68) 32.51,24.13 1.52,24.13 arc(0.45,23.68) 0,22.61
Stack: Top Layer 0.035mm / Dielectric1 1.51mm FR4 er 4.5 / Bottom Layer 0.035mm

## Design rules (mm)
template: JLCPCB Capability(Two Layers Board)
spacing copperThickness1oz (default): track to track 0.102, other pairs 0.152 to 0.3
spacing copperThickness2oz: track to track 0.203, other pairs 0.152 to 0.3
track width copperThickness1oz (default): min 0.127, default 0.254, max 2.54
track width copperThickness2oz: min 0.203, default 0.254, max 2.54
differential pair differentialPair (default): width min 0.127, default 0.254, max 2.54; gap min 0.152, default 0.152
via viaSize (default): diameter min 0.5, default 0.61, max 10; hole min 0.3, default 0.305, max 6.3

## Placement (name value [footprint] x y rotation side)
FPC2  AFC01-S10FCA-00  [FPC-SMD_P0.5-10P_FGS-XJ-H2.0]  17.91 4.19 0 bottom
FPC3  AFC01-S12FCA-00  [FPC-SMD_AFC01-S12FCA-00]  17.91 18.03 0 bottom
NOREF  -  [Pad_e91]  14.9 6.1 0 top
NOREF#2  -  [Pad_e94]  14.9 9.78 0 top
NOREF#3  -  [Pad_e95]  17.61 9.91 0 top
NOREF#4  -  [Pad_e19]  12.19 6.1 0 top
NOREF#5  -  [Pad_e92]  17.61 6.1 0 top
NOREF#6  -  [Pad_e93]  20.32 9.91 0 top
NOREF#7  -  [Pad_e3]  12.19 9.78 0 top
NOREF#8  -  [Pad_ie653]  9.53 21 0 top
NOREF#9  -  [Pad_e90]  20.32 6.1 0 top
NOREF#10  -  [Pad_ie654]  31.53 21 0 top
NOREF#11  -  [Pad_e98]  17.61 13.72 0 top
NOREF#12  -  [Pad_e97]  14.9 13.72 0 top
NOREF#13  -  [Pad_e96]  20.32 13.72 0 top
SW1  TSB008A2526A  [SW-SMD_L6.0-W3.5-LS8.0]  17.91 9.02 180 bottom

## Footprints (pads in the part's own frame, mm; a bottom-side part is the same pattern mirrored in y, then rotated)
FPC-SMD_AFC01-S12FCA-00
  rect 0.3x1.3 smd: 1(-2.751,1.341) 2(-2.251,1.341) 3(-1.751,1.341) 4(-1.25,1.341) 5(-0.75,1.341) 6(-0.249,1.341) 7(0.251,1.341) 8(0.75,1.341) 9(1.249,1.341) 10(1.75,1.341) 11(2.249,1.341) 12(2.75,1.341)
  rect 2x1.6 smd: 13(-4.45,-1.34) 14(4.45,-1.341)
FPC-SMD_P0.5-10P_FGS-XJ-H2.0
  rect 0.3x1.3 smd: 1(-2.25,-1.339) 2(-1.75,-1.339) 3(-1.25,-1.34) 4(-0.75,-1.339) 5(-0.25,-1.34) 6(0.25,-1.339) 7(0.75,-1.339) 8(1.25,-1.339) 9(1.75,-1.339) 10(2.25,-1.34)
  rect 2x1.6 smd: 11(3.95,1.34) 12(-3.95,1.34)
Pad_e3
  rect 1.651x2.921 smd: 2(0,0)
Pad_e19
  rect 1.651x2.921 smd: 2(0,0)
Pad_e90
  rect 1.651x2.921 smd: 2(0,0)
Pad_e91
  rect 1.651x2.921 smd: 2(0,0)
Pad_e92
  rect 1.651x2.921 smd: 2(0,0)
Pad_e93
  rect 1.651x2.921 smd: 2(0,0)
Pad_e94
  rect 1.651x2.921 smd: 2(0,0)
Pad_e95
  rect 1.651x2.921 smd: 2(0,0)
Pad_e96
  rect 1.651x2.921 smd: 2(0,0)
Pad_e97
  rect 1.651x2.921 smd: 2(0,0)
Pad_e98
  rect 1.651x2.921 smd: 2(0,0)
Pad_ie653
  round 4 hole 2.1: (0,0)
Pad_ie654
  round 4 hole 2.1: (0,0)
SW-SMD_L6.0-W3.5-LS8.0
  rect 1.74x1.4 smd: 1(-3.67,0) 2(3.67,0)

## Nets
GND: FPC2.1 FPC2.2 FPC2.3 FPC3.2 FPC3.13 FPC3.14 NOREF#3.2 NOREF#5.2 NOREF#8. NOREF#10. NOREF#11.2 SW1.2
VBUS: FPC2.8 FPC2.9 FPC2.10 FPC3.3 NOREF.2 NOREF#2.2 NOREF#12.2
BAT_DEC: FPC2.4 FPC3.12
CHG_DET: FPC2.5 FPC3.11
IO0: FPC3.1 SW1.1
SERVO2: FPC3.8 NOREF#4.2
SERVO3: FPC3.7 NOREF#7.2
SERVO4: FPC3.6 NOREF#13.2
SERVO5: FPC3.5 NOREF#6.2
SERVO6: FPC3.4 NOREF#9.2
USB_DM: FPC2.6 FPC3.10
USB_DP: FPC2.7 FPC3.9

Pads without a net: FPC2 11 12

## Via types
v1: diameter 0.61, hole 0.305, Top Layer to Bottom Layer, 57 vias

## Routing (per net, layer and track width the routed paths; a pad name or vN(x,y) marks a point on that pad's centre or on a via; arc(x,y) is an arc through that point)
GND: length 25.5
  Top Layer w0.305: v1(17.22,7.04) 17.61,6.65 NOREF#5.2
  Bottom Layer w0.305: 15.66,8.47 15.66,16.69 ; 15.66,8.47 v1(16.21,9.02) ; 15.66,8.47 FPC2.1 ; 16.66,1.52 FPC2.3 16.66,6.48 v1(17.22,7.04) ; v1(16.03,2.29) 16.16,2.41 FPC2.2 16.16,7.78 v1(16.99,8.6)
  vias: v1(9.02,13.21) v1(9.27,11.3) v1(9.27,7.49) v1(9.53,5.84) v1(9.78,1.4) v1(9.91,17.4) v1(9.91,15.37) v1(10.54,3.18) v1(11.43,0.89) v1(11.56,17.91) v1(13.21,20.83) v1(13.21,1.02) v1(14.29,20.83) v1(14.73,1.02) v1(15.72,20.83) v1(15.75,1.02) v1(16.62,1.52) v1(17.27,20.83) v1(17.27,13.46) v1(17.27,12.33) v1(17.27,11.18) v1(18.03,9.65) v1(19.2,20.83) v1(19.43,2.29) v1(20.25,2.29) v1(20.83,20.83) v1(22.23,20.83) v1(23.24,12.57) v1(23.24,11.3) v1(23.24,9.91) v1(23.24,8.26) v1(23.24,6.6) v1(23.24,4.83) v1(23.37,3.68) v1(23.37,2.71) v1(25.27,16.38) v1(26.16,14.86) v1(26.16,12.01) v1(26.16,8.38) v1(26.16,6.14) v1(26.42,3.05) v1(26.42,1.78)
VBUS: length 12.4
  Bottom Layer w0.254: FPC3.3 16.13,16.67 16.13,10.29 19.16,7.26 FPC2.8
  vias: v1(19.43,4.06) v1(19.43,3.35) v1(20.19,4.06) v1(20.19,3.36)
BAT_DEC: length 31
  Bottom Layer w0.152: FPC3.12 20.7,16.65 20.7,15.75 21.08,15.37 22.94,15.37 25.15,13.17 25.15,1.57 24.21,0.64 17.78,0.64 17.16,1.26 FPC2.4
CHG_DET: length 30.1
  Bottom Layer w0.152: FPC3.11 20.16,15.81 20.85,15.11 22.84,15.11 24.89,13.06 24.89,1.67 24.11,0.89 18.16,0.89 17.66,1.39 FPC2.5
IO0: length 16.1
  Top Layer w0.254: v1(16.64,18.16) 17.02,17.78 20.96,17.78 21.72,17.02 v1(21.72,13.46)
  Bottom Layer w0.254: v1(21.72,13.46) 21.72,9.16 SW1.1 ; v1(16.64,18.16) 15.93,18.16 15.16,17.39 FPC3.1
SERVO2: length 22.3
  Top Layer w0.254: NOREF#4.2 10.79,7.49 10.79,14.48 16.26,19.94 v1(18.67,19.94)
  Bottom Layer w0.254: FPC3.8 18.66,19.93 v1(18.67,19.94)
SERVO3: length 15.2
  Top Layer w0.254: v1(17.78,19.18) 16.26,19.18 12.19,15.11 NOREF#7.2
  Bottom Layer w0.254: v1(17.78,19.18) 18.16,18.8 FPC3.7
SERVO4: length 5.1
  Top Layer w0.254: v1(20.45,13.59) NOREF#13.2
  Bottom Layer w0.254: v1(20.45,13.59) 19.3,13.59 17.66,15.24 FPC3.6
SERVO5: length 8.2
  Top Layer w0.254: v1(20.45,10.54) 20.45,10.03 NOREF#6.2
  Bottom Layer w0.254: v1(20.45,10.54) 19.53,11.45 19.53,12.86 17.16,15.23 FPC3.5
SERVO6: length 12.2
  Top Layer w0.254: v1(20.45,7.11) 20.45,6.22 NOREF#9.2
  Bottom Layer w0.254: v1(20.45,7.11) 20.45,7.62 19.18,8.89 19.18,12.71 16.66,15.23 FPC3.4
USB_DM: length 28.9
  Bottom Layer w0.152: FPC3.10 19.66,15.95 20.74,14.86 22.73,14.86 24.64,12.95 24.64,1.78 24,1.14 18.79,1.14 18.16,1.78 FPC2.6
USB_DP: length 27.8
  Bottom Layer w0.152: FPC3.9 19.18,16.67 19.18,16 20.57,14.6 22.61,14.6 24.38,12.83 24.38,1.91 23.88,1.4 19.3,1.4 18.66,2.04 FPC2.7

## Copper pours and planes (outline as drawn; the poured copper is in the pictures)
GND on Top Layer: -0.89,24.13 34.67,24.13 34.67,0 -0.89,0
GND on Bottom Layer: -0.89,24.13 34.67,24.13 34.67,0 -0.89,0
VBUS on Top Layer: 14.04,15.11 20.45,15.11 20.45,3 14.04,3
VBUS on Bottom Layer: 19.14,6.6 20.45,6.6 20.45,3.13 19.14,3.13

Small or netless copper shapes (teardrops, artwork), in the pictures only: 6 on Top Layer, 15 on Bottom Layer

## Text on the board
Top Silkscreen Layer: s+-s | 左转 | 左推 | 右推 | 旋转 | 右转 | 板厚1.0

# Board BaseConnector
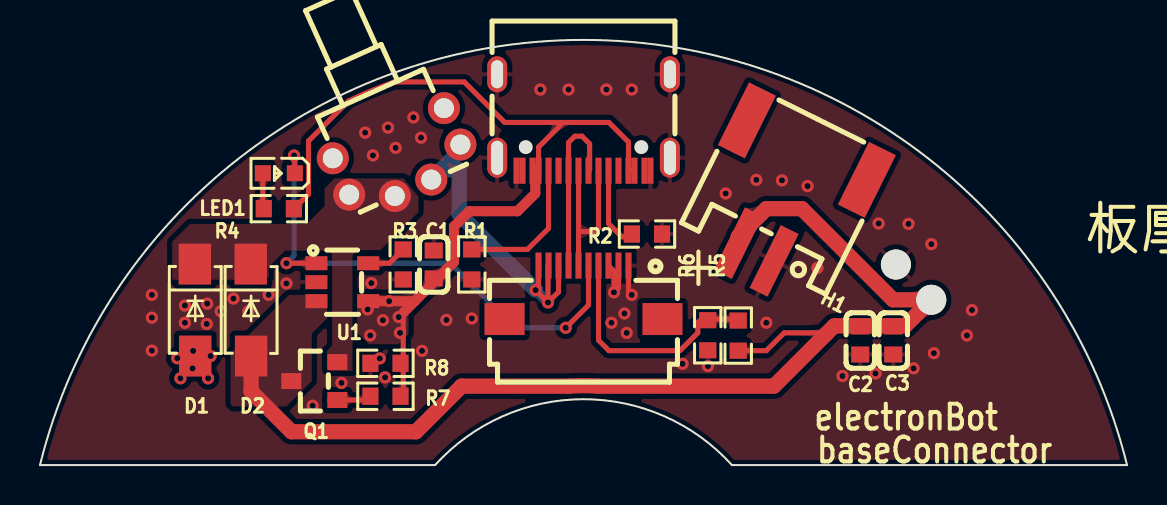
[diagram p5: board, top side]
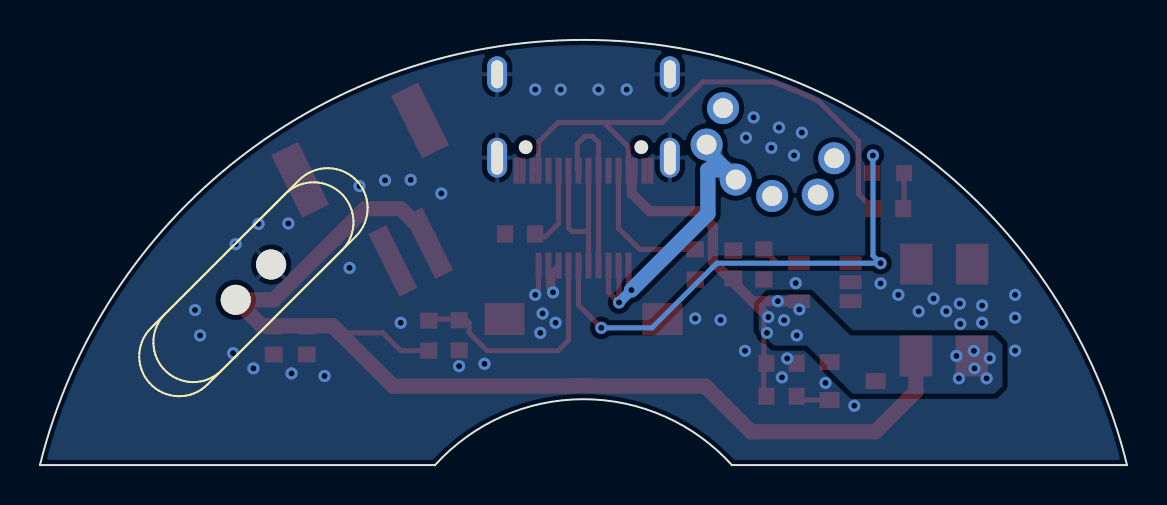
[diagram p6: board, bottom side, seen from below]

Outline 54.37 x 21.3 mm; copper layers: Top Layer, Bottom Layer. Coordinates in mm from the lower left corner of the outline.
Outline path: 0,0 19.76,0 arc(27.19,3.3) 34.61,0 54.37,0 arc(27.19,21.3) 0,0
Stack: Top Layer 0.035mm / Dielectric1 0.91mm FR4 er 4.5 / Bottom Layer 0.035mm

## Design rules (mm)
template: JLCPCB Capability(Two Layers Board)
spacing copperThickness1oz (default): track to track 0.102, other pairs 0.152 to 0.3
spacing copperThickness2oz: track to track 0.203, other pairs 0.152 to 0.3
track width copperThickness1oz (default): min 0.127, default 0.254, max 2.54
track width copperThickness2oz: min 0.203, default 0.254, max 2.54
differential pair differentialPair (default): width min 0.127, default 0.254, max 2.54; gap min 0.152, default 0.152
via viaSize (default): diameter min 0.5, default 0.61, max 10; hole min 0.3, default 0.305, max 6.3

## Placement (name value [footprint] x y rotation side)
C1  4.7uF  [C0603]  19.69 10.05 90 top
C2  10uF  [C0603]  41.03 6.24 270 top
C3  100nF  [C0603]  42.68 6.24 270 top
CN1  DC-磁吸-2P  [2.5X2Pcixi]  43.7 9.16 135 bottom
D1  SS34  [SMA_L4.3-W2.6-LS5.0-FD]  7.76 7.77 90 top
D2  SS34  [SMA_L4.3-W2.6-LS5.0-FD]  10.55 7.77 90 top
FPC1  AFC01-S10FCA-00  [FPC-SMD_P0.5-10P_FGS-XJ-H2.0]  27.19 8.65 180 top
H1  WAFER-PH2.0-2PWB  [CONN-SMD_2P-P2.00_XUNPU_WAFER-PH2.0-2PWB]  37.09 13.23 153.6 top
LED1  KT-0603R  [LED0603-RD]  11.95 14.62 180 top
Q1  AO3401A  [SOT-23_L2.9-W1.3-P1.90-LS2.4-BR]  13.72 4.21 0 top
R1  5.1K  [R0603]  21.6 10.05 90 top
R2  5.1K  [R0603]  30.36 11.58 0 top
R3  2kΩ  [R0603]  18.17 10.05 90 top
R4  1kΩ  [R0603]  11.95 12.85 180 top
R5  100kΩ  [R0603]  34.92 6.49 90 top
R6  100kΩ  [R0603]  33.4 6.5 270 top
R7  5.1K  [R0603]  17.28 3.45 0 top
R8  10kΩ  [R0603]  17.28 5.1 180 top
SW1  XKB5858-Z-E  [SW-TH_XKB5858-Z-E]  18.04 15.26 24.3 top
U1  TP4054  [TSOT-23-5_L2.9-W1.6-P0.95-LS2.8-BR]  15.12 9.16 180 top
USB1  typec  [USB-C-SMD_KH-TYPE-C-16P]  27.19 17.16 180 top

## Footprints (pads in the part's own frame, mm; a bottom-side part is the same pattern mirrored in y, then rotated)
2.5X2Pcixi
  round 1.5 hole 1.5x0.7: 1(-1.249,0.001) 2(1.251,0.001)
C0603
  rect 0.8x0.9 smd: 1(-0.7,0) 2(0.7,0)
CONN-SMD_2P-P2.00_XUNPU_WAFER-PH2.0-2PWB
  rect 1x3.5 smd: 1(-1,2.85) 2(1,2.85)
  rect 1.5x3.5 smd: 3(-3.35,-2.85) 4(3.35,-2.85)
FPC-SMD_P0.5-10P_FGS-XJ-H2.0
  rect 0.3x1.3 smd: 1(-2.25,-1.339) 2(-1.75,-1.339) 3(-1.25,-1.34) 4(-0.75,-1.339) 5(-0.25,-1.34) 6(0.25,-1.339) 7(0.75,-1.339) 8(1.25,-1.339) 9(1.75,-1.339) 10(2.25,-1.34)
  rect 2x1.6 smd: 11(3.95,1.34) 12(-3.95,1.34)
LED0603-RD
  rect 0.8x0.8 smd: 1(-0.799,0) 2(0.799,0)
R0603
  rect 0.806x0.864 smd: 1(-0.753,0) 2(0.753,0)
SMA_L4.3-W2.6-LS5.0-FD
  rect 2.046x1.62 smd: 1(-2.304,-0.009) 2(2.304,0.009)
SOT-23_L2.9-W1.3-P1.90-LS2.4-BR
  rect 1x0.8 smd: 1(1.15,-0.95) 2(1.15,0.95) 3(-1.15,0)
SW-TH_XKB5858-Z-E
  round 1.6 hole 1: 1(-3.05,1.5) 2(-3.05,-0.5) 3(3.05,1.5) 4(3.05,-0.5) 5(-1,-1.5) 6(1,-1.5)
TSOT-23-5_L2.9-W1.6-P0.95-LS2.8-BR
  rect 1.1x0.7 smd: 1(1.294,-0.951) 2(1.294,-0.001) 3(1.294,0.951) 4(-1.294,0.951) 5(-1.294,-0.949)
USB-C-SMD_KH-TYPE-C-16P
  oval 1x2 hole 0.6x1.7: 1(-4.32,1.765) 2(4.32,1.765)
  oval 1x1.8 hole 0.6x1.4: 3(-4.32,-2.415) 4(4.32,-2.415)
  rect 0.3x1.3 smd: A1(-3.35,2.415) A4(-2.55,2.415) A5(-1.25,2.415) A6(-0.25,2.415) A7(0.25,2.415) A8(1.25,2.415) A9(2.55,2.415) A12(3.35,2.415) B1(3.05,2.415) B4(2.25,2.415) B5(1.75,2.415) B6(0.75,2.415) B7(-0.75,2.415) B8(-1.75,2.415) B9(-2.25,2.415) B12(-3.05,2.415)

## Nets
As in the schematic.

Pads without a net: FPC1 11 12; H1 3 4; SW1 1 3; USB1 A8 B8

## Via types
v1: diameter 0.61, hole 0.305, Top Layer to Bottom Layer, 69 vias

## Routing (per net, layer and track width the routed paths; a pad name or vN(x,y) marks a point on that pad's centre or on a via; arc(x,y) is an arc through that point)
GND: length 4.4
  Top Layer w0.254: v1(29.6,8.53) 29.44,8.69 FPC1.1 ; FPC1.3 28.71,9.72 v1(28.71,8.65) 28.94,8.88 FPC1.2
  vias: v1(5.6,8.53) v1(5.6,7.38) v1(5.6,5.73) v1(7.25,7.99) v1(7.25,7.13) v1(8.36,8.09) v1(8.34,7.07) v1(9.04,7.71) v1(9.68,8.34) v1(10.42,7.7) v1(11.44,8.53) v1(12.33,9.1) v1(13.64,2.97) v1(15.08,4.12) v1(16.26,16.66) v1(16.57,9.12) v1(16.65,15.51) v1(17,5.34) v1(17.26,4.39) v1(17.41,16.91) v1(17.79,15.89) v1(18.68,17.42) v1(19.06,16.4) v1(19.11,5.72) v1(20.33,7.27) v1(21.6,7.35) v1(25.03,18.81) v1(26.44,18.81) v1(28.33,18.81) v1(28.58,7.13) v1(29.23,7.59) v1(29.35,6.62) v1(29.6,18.81) v1(32.14,5.07) v1(33.41,4.96) v1(34.3,13.61) v1(35.83,14.29) v1(36.33,7.13) v1(37.11,14.26) v1(38.39,13.98) v1(38.89,9.88) v1(40.14,4.46) v1(41.79,4.59) v1(41.95,12.1) v1(43.44,12.08) v1(43.7,4.84) v1(44.59,11.07) v1(44.71,5.61) v1(46.36,6.5) v1(46.62,7.77)
VBAT: length 56.6
  Top Layer w0.254: 39.34,6.58 39.3,6.62 37.22,6.62 36.33,5.73 R5.1
  Top Layer w0.762: D2.1 10.56,3.69 12.58,1.67 18.8,1.67 21.09,3.96 26.45,3.96 arc(27.19,3.98) 27.93,3.96 36.71,3.96 39.73,6.98 43.28,6.98 CN1.1 42.67,8.28 38.11,12.85 36.33,12.85 34.93,11.44 34.93,11.12
VBUS: length 17.7
  Top Layer w0.254: FPC1.8 25.94,8.67 v1(25.41,8.15) ; v1(25.41,8.15) 24.94,8.62 FPC1.10 ; v1(25.41,8.15) 25.41,9.96 FPC1.9
  Bottom Layer w0.508: v1(25.41,8.15) v1(24.79,8.77)
  Bottom Layer w0.762: v1(24.79,8.77) 20.97,12.59 20.97,14.79 20.06,14.79 ; SW1.6 21.03,15.76 21.03,16.06
VBUS_IN: length 45.4
  Top Layer w0.254: USB1.B4 24.94,15.93 26.17,17.16 ; R7.2 18.17,3.58 18.17,7.64 ; 26.17,17.16 23.25,17.16 21.22,19.2 17.72,19.2 arc(16.57,18.75) 15.44,18.25 13.43,16.23 13.43,13.58 R4.1 ; 26.17,17.16 28.46,17.16 29.44,16.18 USB1.B9 USB1.A4
  Top Layer w0.508: C1.1 19.88,9.35 ; 19.88,9.35 20.71,10.18 20.71,11.96 21.47,12.72 23.88,12.72 24.77,13.61 24.77,14.83 ; 19.88,9.35 18.74,8.21 ; 18.74,8.21 v1(17.47,8.21) 16.42,8.21 ; 18.74,8.21 18.17,7.64 ; v1(7.63,4.84) 7.77,4.98 D1.1
  vias: v1(6.87,5.35) v1(7.02,4.35) v1(7.66,5.72) v1(8.41,4.35) v1(8.53,5.47) v1(16.39,7.8) v1(16.52,6.5) v1(17.15,7.26) v1(17.94,7.42) v1(18.01,6.62)
BAT_DEC: length 11.9
  Top Layer w0.254: FPC1.4 27.94,6.25 28.46,5.73 32.01,5.73 32.9,6.62 32.9,7.13 33.08,7.31 34.86,7.31 R5.2
CHG_DET: length 26.9
  Top Layer w0.254: FPC1.5 27.44,8.02 v1(26.3,6.88) ; LED1.1 12.75,15.47 v1(12.71,15.51) ; U1.1 v1(12.33,10.11)
  Bottom Layer w0.254: v1(12.71,15.51) 12.71,10.49 v1(12.33,10.11) 20.52,10.11 23.76,6.88 v1(26.3,6.88)
USB_DM: length 8.7
  Top Layer w0.254: 26.94,11.72 26.95,11.7 27.76,11.7 27.94,11.88 USB1.B7 ; 26.94,11.72 USB1.A7 ; 26.94,11.72 FPC1.6
USB_DP: length 8.9
  Top Layer w0.254: FPC1.7 USB1.B6 26.44,16.16 26.75,16.48 27.11,16.48 27.49,16.09 27.49,14.8 USB1.A6
$1N1500: length 7.4
  Top Layer w0.254: USB1.B5 25.44,11.86 24.38,10.8 21.34,10.8
$1N1502: length 4.1
  Top Layer w0.254: USB1.A5 28.44,12.1 29.1,11.44 29.47,11.44 R2.1
$1N5040: length 2
  Top Layer w0.254: R3.2 17.48,10.11 16.42,10.11
$1N5043: length 1.8
  Top Layer w0.254: LED1.2 11.15,12.89 R4.2
$1N5835: length 2.1
  Top Layer w0.254: R7.1 16.34,3.26 14.49,3.26

## Copper pours and planes (outline as drawn; the poured copper is in the pictures)
GND on Top Layer: -14.09,23.01 69.6,23.01 69.6,-39.86 -14.09,-39.86
GND on Bottom Layer: -7.87,31.51 63.64,31.51 63.64,-36.3 -7.87,-36.3
VBAT on Top Layer: 9.53,8.53 14.36,8.53 14.36,2.94 9.53,2.94
VBUS_IN on Top Layer: 15.87,8.53 18.44,8.53 18.44,6.05 15.87,6.05
VBUS_IN on Bottom Layer: 6.23,8.53 18.42,8.53 18.42,3.57 6.23,3.57
$1N5920 on Top Layer: 6.61,14.37 18.93,14.37 18.93,4.72 6.61,4.72

Small or netless copper shapes (teardrops, artwork), in the pictures only: 56 on Top Layer, 10 on Bottom Layer

## Text on the board
Top Silkscreen Layer: electronBot | baseConnector | + | 板厚1.0

# Board mainBoard
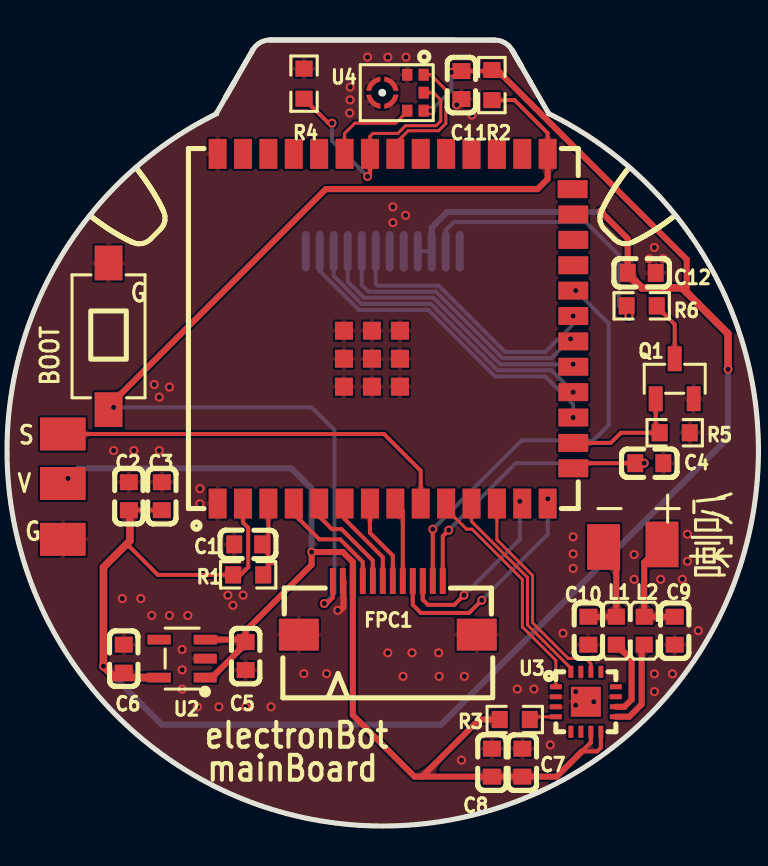
[diagram p7: board, top side]
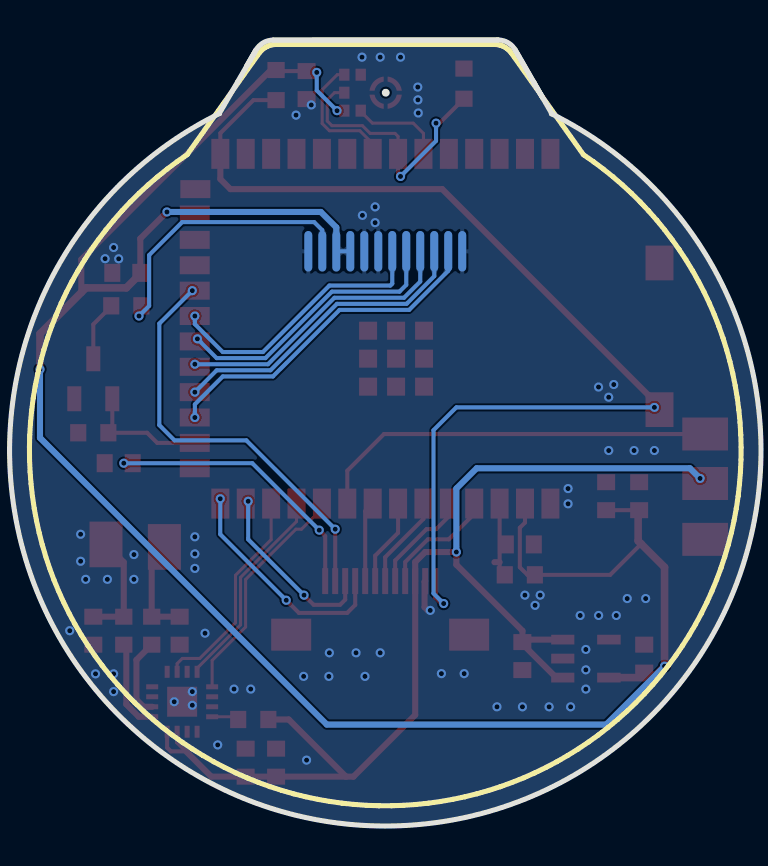
[diagram p8: board, bottom side, seen from below]

Outline 37.59 x 39.34 mm; copper layers: Top Layer, Bottom Layer. Coordinates in mm from the lower left corner of the outline.
Outline path: 11.37,37.24 10.92,36.45 11.37,37.24 ; 11.37,37.24 10.47,35.67 10.48,35.65 arc(18.8,0) 27.08,35.66 27.09,35.66 26.18,37.24 25.26,38.83 ; 11.37,37.24 12.29,38.84 ; 11.37,37.24 12.29,38.84 ; 12.29,38.84 arc(12.65,39.2) 13.16,39.34 ; 13.16,39.34 24.39,39.33 ; 13.16,39.34 24.39,39.33 ; 24.39,39.33 arc(24.89,39.2) 25.26,38.83 ; 25.26,38.83 25.72,38.04 25.26,38.83
Stack: Top Layer 0.035mm / Dielectric 1 0.91mm PP-006 er 4.1 / Bottom Layer 0.035mm

## Design rules (mm)
template: 自定义配置
spacing copperThickness1oz (default): track to track 0.102, other pairs 0.102 to 0.102
spacing copperThickness2oz: track to track 0.203, other pairs 0.152 to 0.3
spacing Clearance: track to track 0.102, other pairs 0 to 0.102
spacing safeClearance: track to track 0.102, other pairs 0.102 to 0.102
track width copperThickness1oz (default): min 0.127, default 0.254, max 2.54
track width copperThickness2oz: min 0.203, default 0.254, max 2.54
track width GND: min 0.102, default 0.254, max 1.27
track width Logo: min 0.003, default 0.254, max 2.54
track width trackWidth: min 0.127, default 0.254, max 2.54
track width VCC: min 0.102, default 0.254, max 1.27
track width Width: min 0.102, default 0.102, max 254
differential pair differentialPair (default): width min 0.127, default 0.254, max 2.54; gap min 0.152, default 0.152
differential pair DiffPairsRouting: width min 0.381, default 0.381, max 0.381; gap min 0.229, default 0.229
via viaSize (default): diameter min 0.381, default 0.61, max 10; hole min 0.152, default 0.305, max 5.999

## Placement (name value [footprint] x y rotation side)
C1  1uF  [C0603]  12.06 14.09 0 top
C2  10uF  [C0603]  6.09 16.51 90 top
C3  100nF  [C0603]  7.74 16.51 270 top
C4  100nF  [C0603]  32.13 18.16 180 top
C5  10uF  [C0603]  11.93 8.51 270 top
C6  10uF  [C0603]  5.84 8.38 90 top
C7  100nF  [C0603]  25.78 3.17 90 top
C8  10uF  [C0603]  24.25 3.17 90 top
C9  220pF  [C0603]  33.4 9.78 270 top
C10  220pF  [C0603]  29.08 9.78 90 top
C11  100nF  [C0603]  22.73 37.08 270 top
C12  100nF  [C0603]  31.74 27.68 180 top
FPC1  AFC01-S12FCA-00  [FPC-SMD_AFC01-S12FCA-00]  19.04 10.92 0 top
L1  BLM18PG121SN1D  [L0603]  30.47 9.78 90 top
L2  BLM18PG121SN1D  [L0603]  31.87 9.78 90 top
NOREF  -  [Pad_e305]  2.79 19.62 0 top
NOREF#2  -  [Pad_e306]  2.79 17.14 0 top
NOREF#3  -  [Pad_e307]  2.79 14.35 0 top
NOREF#4  -  [Pad_e311]  29.84 13.97 90 top
NOREF#5  -  [Pad_e312]  32.76 14.09 90 top
Q1  AO3400A  [SOT-23-3_L2.9-W1.3-P1.90-LS2.4-BR]  33.4 22.38 270 top
R1  10kΩ  [R0603]  12.06 12.57 180 top
R2  10kΩ  [R0603]  24.25 37.08 270 top
R3  1MΩ  [R0603]  25.39 5.33 180 top
R4  1MΩ  [R0603]  14.85 37.15 90 top
R5  10kΩ  [R0603]  33.4 19.68 180 top
R6  10Ω  [R0603]  31.74 26.03 180 top
S1  -  [LCD-240x240-ROUND]  18.79 20.7 0 bottom
SW1  TSB008A2526A  [SW-SMD_L6.0-W3.5-LS8.0]  5.07 24.51 90 top
U1  ESP32-S3-WROOM-1U  [wirelm-smd_esp32-s3-wroom-1u]  19.43 24.89 90 top
U2  HE9073A33M5R  [SOT-23-5_L3.0-W1.7-P0.95-LS2.8-BL]  8.76 8.38 90 top
U3  MAX98357AETE+T  [TQFN-16_L3.0-W3.0-P0.50-BL-EP1.5]  28.95 6.22 270 top
U4  ICS-43434  [MIC-SMD_6P-L3.5-W2.7-P0.90-BL]  19.55 36.7 180 top

## Footprints (pads in the part's own frame, mm; a bottom-side part is the same pattern mirrored in y, then rotated)
C0603
  rect 0.8x0.9 smd: 1(-0.7,0) 2(0.7,0)
FPC-SMD_AFC01-S12FCA-00
  rect 0.3x1.3 smd: 1(-2.751,1.341) 2(-2.251,1.341) 3(-1.751,1.341) 4(-1.25,1.341) 5(-0.75,1.341) 6(-0.249,1.341) 7(0.251,1.341) 8(0.75,1.341) 9(1.249,1.341) 10(1.75,1.341) 11(2.249,1.341) 12(2.75,1.341)
  rect 2x1.6 smd: 13(-4.45,-1.34) 14(4.45,-1.341)
L0603
  rect 0.8x0.864 smd: 1(-0.7,0) 2(0.7,0)
LCD-240x240-ROUND
  rrect 0.4x2.032 smd: 1(3.85,-8.066) 2(3.15,-8.066) 3(2.45,-8.066) 4(1.75,-8.066) 5(1.05,-8.066) 6(0.35,-8.066) 7(-0.35,-8.066) 8(-1.05,-8.066) 9(-1.75,-8.066) 10(-2.45,-8.066) 11(-3.15,-8.066) 12(-3.85,-8.066)
MIC-SMD_6P-L3.5-W2.7-P0.90-BL
  rect 0.52x0.6 smd: 1(-1.286,-0.9) 2(-0.465,-0.9) 4(-0.465,0.9) 5(-1.286,0.9) 6(-1.286,0)
  custom 0.709x0.71 smd: 3(0.276,-0.452) 3(0.329,0.505) 3(1.234,-0.505) 3(1.286,0.452)
Pad_e305
  rect 2.286x1.651 smd: 2(0,0)
Pad_e306
  rect 2.286x1.651 smd: 2(0,0)
Pad_e307
  rect 2.286x1.651 smd: 2(0,0)
Pad_e311
  rect 2.286x1.651 smd: 2(0,0)
Pad_e312
  rect 2.286x1.651 smd: 2(0,0)
R0603
  rect 0.806x0.864 smd: 1(-0.753,0) 2(0.753,0)
SOT-23-3_L2.9-W1.3-P1.90-LS2.4-BR
  rect 1.25x0.7 smd: 1(1,-0.95) 2(1,0.95) 3(-1,0)
SOT-23-5_L3.0-W1.7-P0.95-LS2.8-BL
  rect 0.49x1.157 smd: 1(-0.95,-1.153) 2(0,-1.153) 3(0.95,-1.153)
  rect 0.49x1.175 smd: 4(0.95,1.153) 5(-0.95,1.153)
SW-SMD_L6.0-W3.5-LS8.0
  rect 1.74x1.4 smd: 1(-3.67,0) 2(3.67,0)
TQFN-16_L3.0-W3.0-P0.50-BL-EP1.5
  rect 0.25x0.6 smd: 1(-0.749,-1.5) 2(-0.248,-1.5) 3(0.252,-1.5) 4(0.751,-1.5) 9(0.75,1.5) 10(0.25,1.5) 11(-0.25,1.5) 12(-0.749,1.5)
  rect 0.6x0.25 smd: 5(1.5,-0.748) 6(1.5,-0.248) 7(1.5,0.252) 8(1.5,0.752) 13(-1.5,0.752) 14(-1.5,0.252) 15(-1.5,-0.248) 16(-1.5,-0.748)
  rect 1.5x1.5 smd: 17(0,0)
wirelm-smd_esp32-s3-wroom-1u
  rect 1.5x0.9 smd: 1(-8.75,8.895) 2(-8.75,7.625) 3(-8.75,6.355) 4(-8.75,5.085) 5(-8.75,3.815) 6(-8.75,2.545) 7(-8.75,1.275) 8(-8.75,0.005) 9(-8.75,-1.265) 10(-8.75,-2.535) 11(-8.75,-3.805) 12(-8.75,-5.075) 13(-8.75,-6.345) 14(-8.75,-7.615) 27(8.75,-7.615) 28(8.75,-6.345) 29(8.75,-5.075) 30(8.75,-3.805) 31(8.75,-2.535) 32(8.75,-1.265) 33(8.75,0.005) 34(8.75,1.275) 35(8.75,2.545) 36(8.75,3.815) 37(8.75,5.085) 38(8.75,6.355) 39(8.75,7.625) 40(8.75,8.895)
  rect 0.9x1.5 smd: 15(-6.985,-8.895) 16(-5.715,-8.895) 17(-4.445,-8.895) 18(-3.175,-8.895) 19(-1.905,-8.895) 20(-0.635,-8.895) 21(0.635,-8.895) 22(1.905,-8.895) 23(3.175,-8.895) 24(4.445,-8.895) 25(5.715,-8.895) 26(6.985,-8.865)
  rect 0.9x0.9 smd: 41(-2.9,2.575) 41(-2.9,1.175) 41(-2.9,-0.225) 41(-1.5,2.575) 41(-1.5,1.175) 41(-1.5,-0.225) 41(-0.1,2.575) 41(-0.1,1.175) 41(-0.1,-0.225)

## Nets
As in the schematic, except:
GND: C1.1 C2.2 C3.1 C4.1 C5.2 C6.2 C7.2 C8.2 C9.2 C10.1 C11.2 C12.1 FPC1.2 FPC1.13 FPC1.14 NOREF#3.2 Q1.2 R4.2 R5.1 S1.1 S1.5 S1.6 S1.12 SW1.2 U1.1 U1.40 U1.41 U2.2 U3.2 U3.3 U3.11 U3.15 U3.17 U4.2 U4.3
VBUS: C5.1 C7.1 C8.1 FPC1.3 NOREF#2.2 R3.2 U2.1 U2.3 U3.7 U3.8
SERVO1: NOREF.2 U1.9
VO+: C9.1 L2.2 NOREF#5.2
VO-: C10.2 L1.2 NOREF#4.2

Pads without a net: U1 23 24 25 26 28 29 30 31 32 38 39; U2 4; U3 5 6 12 13

## Via types
v1: diameter 0.457, hole 0.254, Top Layer to Bottom Layer, 92 vias

## Routing (per net, layer and track width the routed paths; a pad name or vN(x,y) marks a point on that pad's centre or on a via; arc(x,y) is an arc through that point)
GND: length 1.7
  Top Layer w0.305: v1(16.54,10.79) 16.67,10.79 16.83,10.95 16.83,12.23 FPC1.2
  vias: v1(5.33,18.79) v1(5.77,11.38) v1(6.34,18.79) v1(6.69,11.38) v1(7.23,10.54) v1(7.36,22.09) v1(7.61,21.46) v1(7.61,18.79) v1(8.12,21.97) v1(8.12,10.54) v1(8.76,8.84) v1(8.76,7.82) v1(8.76,6.85) v1(9.04,10.54) v1(9.52,5.97) v1(9.65,16.89) v1(9.65,16.13) v1(10.59,5.97) v1(11.04,11.55) v1(11.3,11.05) v1(11.81,11.55) v1(11.93,5.97) v1(13.2,5.97) v1(14.84,7.63) v1(15.98,7.63) v1(17.14,35.68) v1(17.16,36.98) v1(17.16,36.34) v1(18.03,38.48) v1(19.04,38.48) v1(19.04,8.67) v1(19.3,30.98) v1(19.3,30.2) v1(19.81,7.49) v1(19.93,30.56) v1(19.95,38.48) v1(20.25,8.67) v1(21.59,8.67) v1(21.61,7.49) v1(22.49,36.09) v1(22.73,3.3) v1(22.87,7.49) v1(23.25,35.58) v1(25.52,6.85) v1(26.36,6.85) v1(27.17,4.06) v1(27.81,9.65) v1(28.32,14.47) v1(28.32,13.62) v1(28.32,12.89) v1(28.44,6.73) v1(28.44,6.05) v1(29.35,6.22) v1(31.36,13.59) v1(31.36,12.35) v1(32.13,28.39) v1(32.38,28.95) v1(32.38,7.62) v1(32.38,6.73) v1(32.69,12.35) v1(32.81,28.39) v1(33.28,7.62) v1(33.78,12.35) v1(34.03,14.6) v1(34.03,13.25) v1(34.58,9.78)
VBUS: length 58.3
  Top Layer w0.203: U3.8 29.7,3.92 29.52,3.74 28.75,3.74 29.2,4.19 U3.7
  Top Layer w0.305: 11.93,9.06 11.88,9.06 10.24,7.43 9.98,7.43 ; 11.93,9.06 11.93,9.77 15.23,13.08 v1(15.23,13.71) 16.79,13.71 17.29,13.21 FPC1.3 17.29,5.56 20.38,2.47 20.76,2.47 ; 11.93,9.06 11.66,9.33 9.98,9.33 ; 20.76,2.47 23.62,5.33 R3.2 ; 20.76,2.47 C8.1 C7.1 27.49,2.47 28.75,3.74 ; v1(3.04,17.4) NOREF#2.2
  Bottom Layer w0.305: v1(3.04,17.4) 3.55,17.9 14.22,17.9 15.23,16.89 v1(15.23,13.71)
VCC_3V3: length 107.5
  Top Layer w0.203: C3.2 C2.1 ; U4.5 v1(21.2,35.8) ; 5.99,14.12 7.54,12.57 R1.2 11.68,12.57 12.06,12.95 12.06,14.93 11.8,15.19 U1.2 ; v1(22.22,37.72) 23.05,37.72 23.12,37.78 24.2,37.78 R2.1
  Top Layer w0.305: 34,26.7 34,28.35 24.51,37.83 R2.1 ; v1(29.71,30.73) 31.04,29.4 C12.2
  Top Layer w0.381: 6.14,15.81 6.14,14.27 4.82,12.95 v1(4.82,8) 5.39,7.43 U2.5 ; v1(36.06,22.86) 36.06,24.63 33.76,26.93 31.74,26.93 31.04,27.63 C12.2
  Bottom Layer w0.203: v1(22.22,37.72) 22.22,36.82 v1(21.2,35.8) ; S1.4 S1.3
  Bottom Layer w0.305: v1(29.71,30.73) 22.01,30.73 21.24,29.96 S1.3 ; v1(4.82,8) 7.74,5.08 21.71,5.08 36.06,19.43 v1(36.06,22.86)
357_BCLK: length 10.5
  Top Layer w0.152: U3.16 28.2,7.89 26.03,10.07 26.03,12.44 23.23,15.24 U1.11
357_DIN: length 11.6
  Top Layer w0.152: U1.10 21.96,15.88 22.98,14.86 23.26,14.86 25.78,12.34 25.78,9.96 27.45,8.29 U3.1
357_LRCLK: length 10.9
  Top Layer w0.152: U3.14 29.2,8.13 28.94,8.39 28.07,8.39 26.28,10.17 26.28,12.55 24.5,14.33 U1.12
441_SCK: length 4.7
  Top Layer w0.152: U4.4 20.02,35.76 19.43,35.18 17.39,35.18 16.88,34.66 U1.35
441_SD: length 13.3
  Top Layer w0.152: U4.6 21.33,36.7 21.69,36.34 21.69,35.28 21.46,35.05 19.93,35.05 19.55,34.66 18.3,34.66 18.15,34.51 U1.34
  Top Layer w0.203: R4.1 16.08,35.18 v1(16.25,35.18) ; v1(18.03,32.51) 18.15,32.63 U1.34
  Bottom Layer w0.203: v1(16.25,35.18) 16.25,34.29 v1(18.03,32.51)
441_WS: length 6.6
  Top Layer w0.152: U1.33 19.42,34.15 20.06,34.79 21.58,34.79 21.95,35.16 21.95,36.85 21.19,37.6 20.84,37.6
BAT_DEC: length 17.5
  Top Layer w0.203: v1(22.09,14.81) 21.79,14.51 FPC1.12 ; v1(31.87,18.16) C4.2 28.57,18.16 U1.15
  Bottom Layer w0.203: v1(31.87,18.16) 25.44,18.16 v1(22.09,14.81)
CHG_DET: length 21.1
  Top Layer w0.203: v1(28.44,26.79) U1.22 ; FPC1.11 v1(21.29,14.86)
  Bottom Layer w0.203: v1(28.44,26.79) 30.09,25.14 30.09,20.06 29.33,19.3 25.74,19.3 v1(21.29,14.86)
EN: length 3.9
  Top Layer w0.203: U1.3 13.07,12.83 R1.1
  Top Layer w0.305: 13.33,13.2 13.07,13.2
IO0: length 54.7
  Top Layer w0.203: v1(5.33,20.95) 5.19,20.95 SW1.1 ; R2.2 25.39,36.33 27.04,34.67 U1.27 ; FPC1.1 16.29,11.43 16,11.13 v1(15.87,11.13)
  Top Layer w0.305: SW1.1 5.07,21.01 15.94,31.87 26.54,31.87 27.04,32.38 U1.27
  Bottom Layer w0.203: v1(5.33,20.95) 15.23,20.95 16.38,19.81 16.38,11.64 v1(15.87,11.13)
LCD_BL: length 6.3
  Top Layer w0.203: U1.16 30.2,19.17 30.71,19.68 R5.2 32.45,19.88 Q1.1
LCD_CS: length 14
  Bottom Layer w0.203: v1(28.19,24.38) 27.22,23.42 24.79,23.42 21.46,26.74 18.08,26.74 17.74,27.08 S1.8
LCD_DC: length 13.9
  Top Layer w0.203: v1(28.32,25.52) U1.21
  Bottom Layer w0.203: v1(28.32,25.52) 28.32,25.12 26.92,23.72 24.91,23.72 21.58,27.05 18.54,27.05 18.44,27.14 S1.7
LCD_LEDK: length 14.4
  Top Layer w0.203: R6.2 31.11,25.91 v1(31.11,25.52)
  Bottom Layer w0.203: S1.2 21.94,29.82 22.35,30.22 28.95,30.22 30.6,28.57 30.6,26.03 v1(31.11,25.52)
LCD_RST: length 17.1
  Top Layer w0.203: v1(28.32,20.44) U1.17
  Bottom Layer w0.203: v1(28.32,20.44) 28.32,21.1 26.92,22.5 24.41,22.5 21.08,25.83 17.6,25.83 15.64,27.78 S1.11
LCD_SCL: length 14.6
  Top Layer w0.203: v1(28.32,23.11) 28.32,23.11 U1.19
  Bottom Layer w0.203: v1(28.32,23.11) 24.66,23.11 21.33,26.44 17.85,26.44 17.04,27.25 S1.9
LCD_SDA: length 15.6
  Top Layer w0.203: v1(28.32,21.71) U1.18
  Bottom Layer w0.203: S1.10 16.34,27.52 17.72,26.13 21.21,26.13 24.53,22.81 27.22,22.81 v1(28.32,21.71)
SERVO1: length 20.3
  Top Layer w0.203: U1.9 20.69,17.78 18.85,19.62 NOREF.2
SERVO2: length 4
  Top Layer w0.203: U1.8 19.79,15.76 FPC1.8
SERVO3: length 4.4
  Top Layer w0.203: U1.7 18.15,14.67 19.3,13.53 FPC1.7
SERVO4: length 4.7
  Top Layer w0.203: FPC1.6 18.8,13.45 16.88,15.37 U1.6
SERVO5: length 5.3
  Top Layer w0.203: U1.5 15.61,15.5 16.25,14.86 16.73,14.86 18.29,13.29 FPC1.5
SERVO6: length 5.9
  Top Layer w0.203: FPC1.4 17.79,13.21 16.66,14.35 15.62,14.35 14.34,15.62 U1.4
UART_RX: length 0.6
  Top Layer w0.254: U1.36 15.62,33.63 15.62,33.02
USB_DM: length 9.3
  Top Layer w0.203: v1(25.65,16.25) 25.76,16.14 U1.13 ; v1(22.85,11.55) 22.37,11.07 21.05,11.07 20.79,11.33 FPC1.10
  Bottom Layer w0.203: v1(25.65,16.25) 25.65,14.35 v1(22.85,11.55)
USB_DP: length 11.8
  Top Layer w0.203: U1.14 27.04,16.37 v1(27.05,16.38) ; v1(23.74,11.3) 23.11,10.66 20.7,10.66 20.29,11.07 FPC1.9
  Bottom Layer w0.203: v1(27.05,16.38) 27.05,14.6 v1(23.74,11.3)
VO+: length 5.5
  Top Layer w0.305: NOREF#5.2 31.87,13.2 L2.2 C9.1
VO-: length 5.2
  Top Layer w0.305: C10.2 L1.2 30.47,13.33 NOREF#4.2
$1N8026: length 3
  Top Layer w0.203: R6.1 32.5,26 33.4,25.11 Q1.3
$1N15184: length 1.4
  Top Layer w0.152: U3.4 26.29,5.47 R3.1
$1N15193: length 4
  Top Layer w0.305: U3.10 30.88,5.97 31.24,6.32 31.24,8.31 L1.1
$1N15194: length 4.6
  Top Layer w0.305: L2.1 31.74,8.95 31.74,6.09 31.12,5.47 U3.9

## Copper pours and planes (outline as drawn; the poured copper is in the pictures)
GND on Top Layer: -2.04,40 38.6,40 38.6,-1.91 -2.04,-1.91
GND on Bottom Layer: -2.16,40.13 38.48,40.13 38.48,-1.78 -2.16,-1.78

Small or netless copper shapes (teardrops, artwork), in the pictures only: 111 on Top Layer, 34 on Bottom Layer

## Text on the board
Top Silkscreen Layer: G | BOOT | V | S | electronBot | mainBoard | - | + | 喇叭 | 板厚1.0
